# Altium project WroSat_RAD_SiPMT_detector_platform.PrjPCB (part 1 of 2)
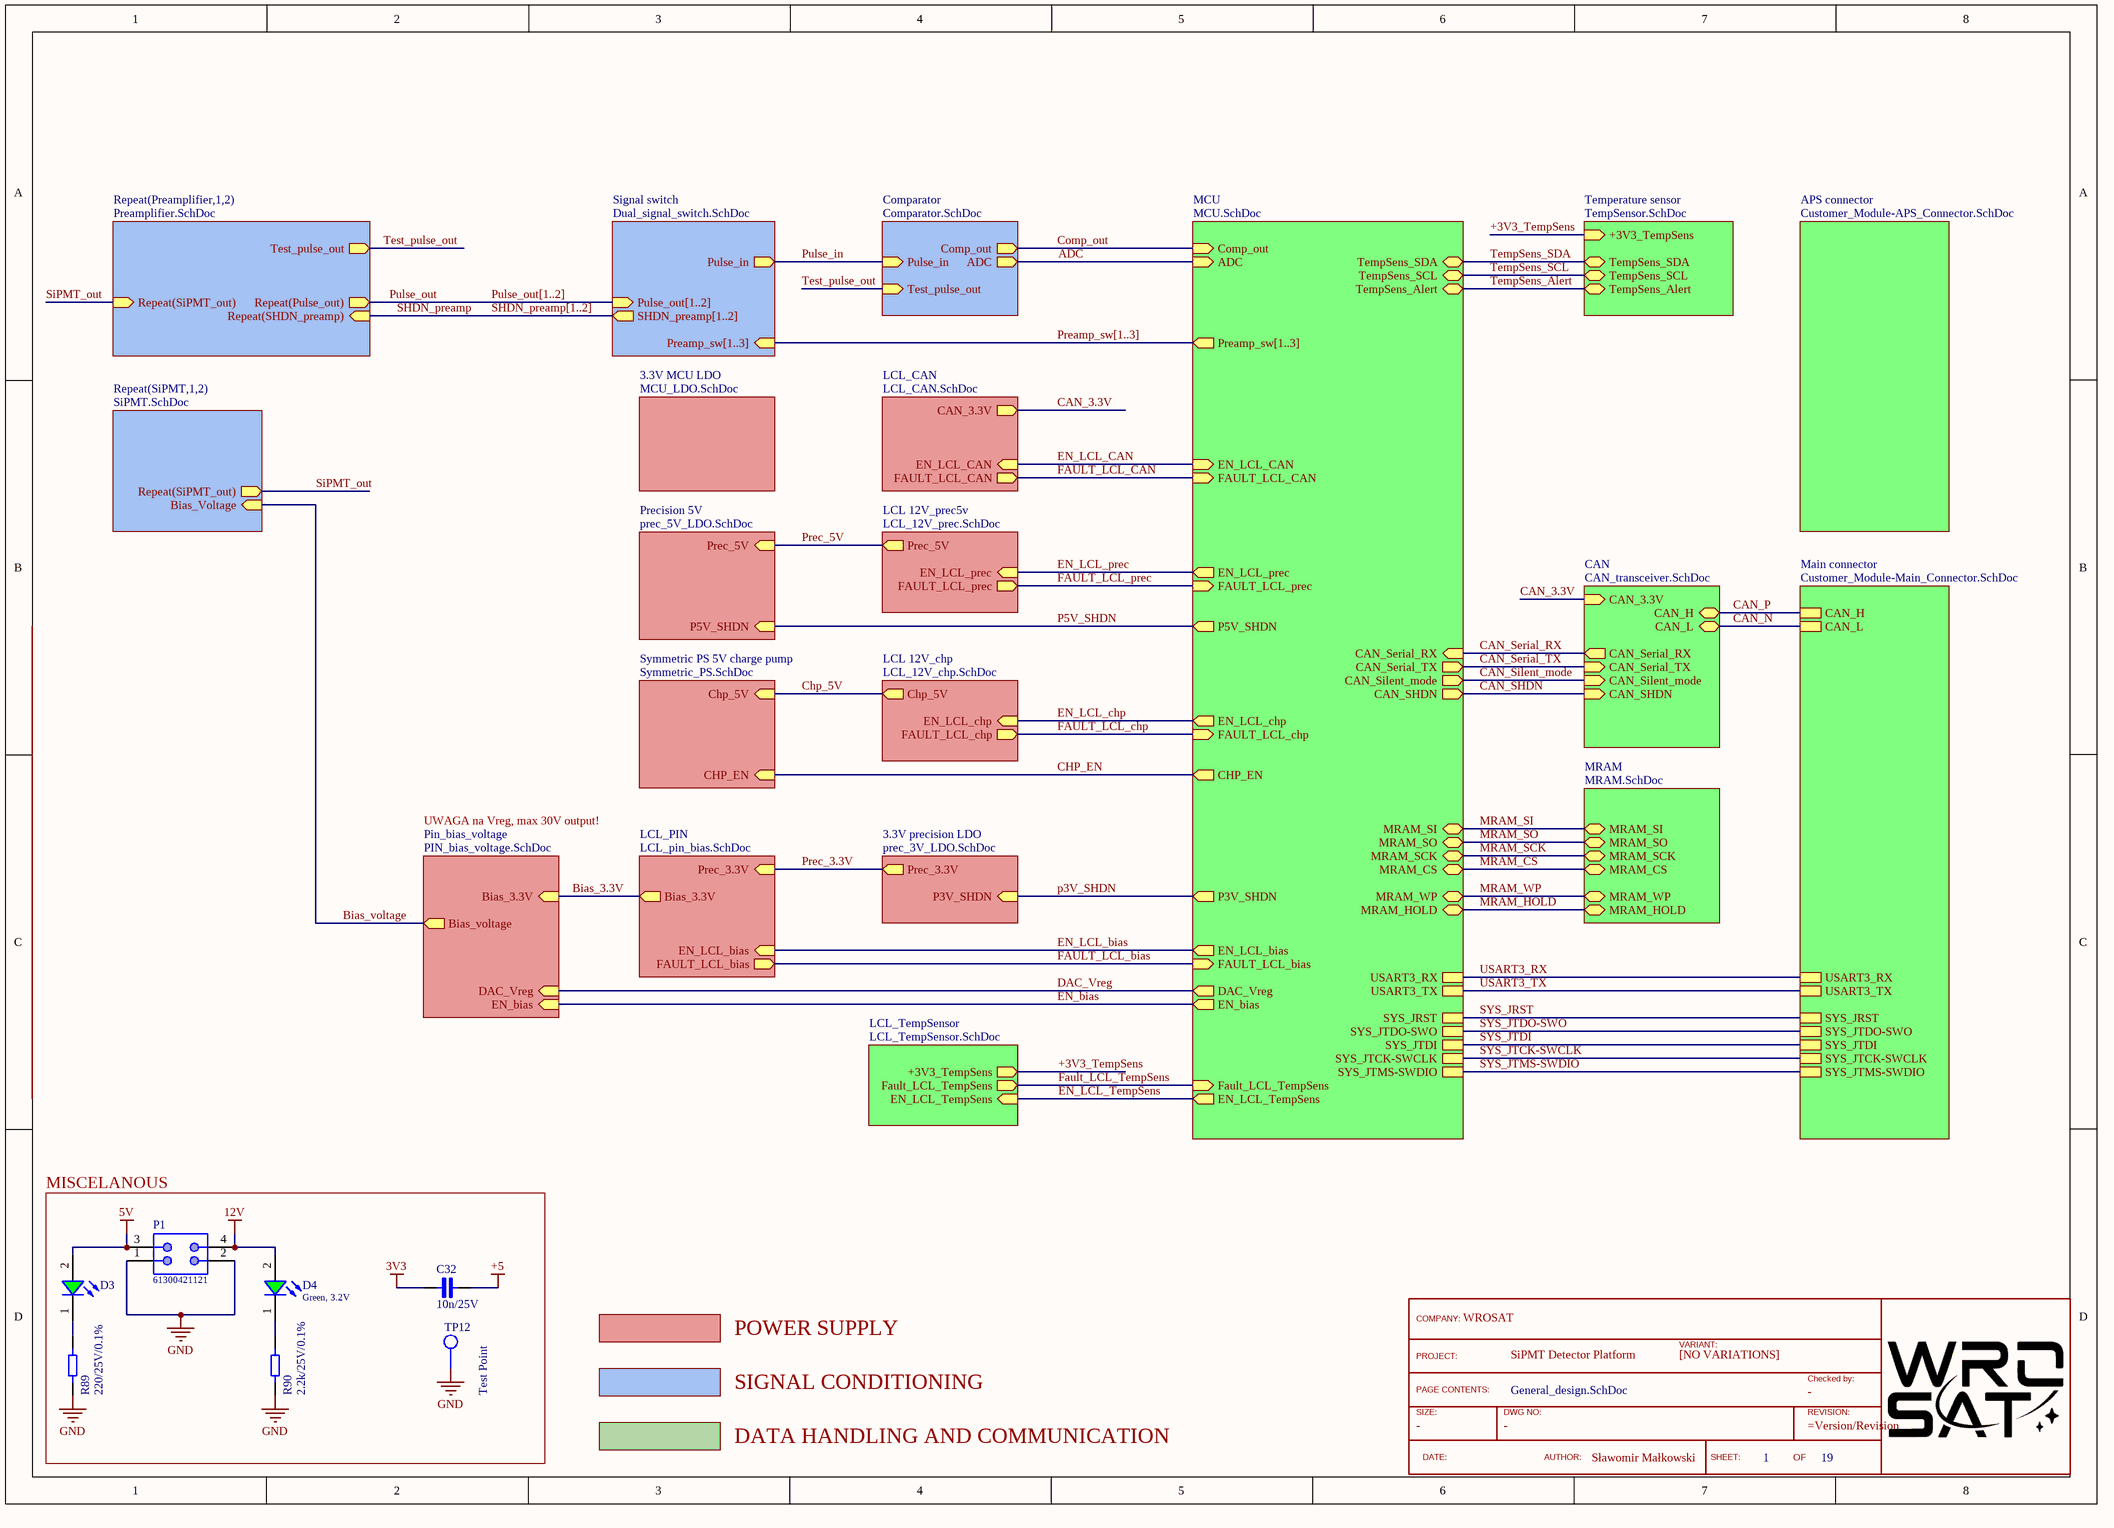
[diagram p0: General_design.SchDoc]
Company: WROSAT; Project: SiPMT Detector Platform; ProjectAuthor: Sławomir Małkowski; ProjectDate: 08.01.2020; Revision/Version: 2.0
21 sheets, 383 parts. Net scope: hierarchical (ports join the sheet entries above them; power ports are global).
Board file: WroSat_RAD_SiPMT_detector_platform.PcbDoc
Sheets:
  General_design.SchDoc
    SiPMT1 = SiPMT.SchDoc
    SiPMT2 = SiPMT.SchDoc
    Preamplifier1 = Preamplifier.SchDoc
    Preamplifier2 = Preamplifier.SchDoc
    Pin_bias_voltage = PIN_bias_voltage.SchDoc
    MCU = MCU.SchDoc
    Comparator = Comparator.SchDoc
    Symmetric PS 5V charge pump = Symmetric_PS.SchDoc
    3.3V precision LDO = prec_3V_LDO.SchDoc
    CAN = CAN_transceiver.SchDoc
    MRAM = MRAM.SchDoc
    LCL_PIN = LCL_pin_bias.SchDoc
    Precision 5V = prec_5V_LDO.SchDoc
    LCL 12V_prec5v = LCL_12V_prec.SchDoc
    LCL 12V_chp = LCL_12V_chp.SchDoc
    Signal switch = Dual_signal_switch.SchDoc
    3.3V MCU LDO = MCU_LDO.SchDoc
    LCL_CAN = LCL_CAN.SchDoc
    APS connector = Customer_Module-APS_Connector.SchDoc
    Main connector = Customer_Module-Main_Connector.SchDoc
    Temperature sensor = TempSensor.SchDoc
    LCL_TempSensor = LCL_TempSensor.SchDoc

## Sheet General_design.SchDoc
size A3; Author: Sławomir Małkowski; Organization: Altium Limited; Address1: L3, 12a Rodborough Rd; Address2: Frenchs Forest; Address3: NSW; Address4: Australia 2086; DocumentNumber: 1; SheetNumber: 1; SheetTotal: 19

### Parts
(Parts that share a designator on the sheet are numbered #1, #2 ... from top to bottom, then left to right.)
?#1  TitleBlock  (value not drawn)  (graphical)
C32  10n/25V  [Cap_0402]
D3  Green, 3.2V  [WL-SMCW_0603_H=0.7mm]  (value not drawn)
D4  Green, 3.2V  [WL-SMCW_0603_H=0.7mm]
P1  61300421121  [61300421121]
R89  220/25V/0.1%  [RES_0402]
R90  2.2k/25V/0.1%  [RES_0402]
TP12  Test Point  [Test Point SMT]

### Blocks framed on the sheet
MISCELANOUS: C32 D3 D4 P1 R89 R90 TP12

### Sub-sheets
3.3V MCU LDO = MCU_LDO.SchDoc: no entries
3.3V precision LDO = prec_3V_LDO.SchDoc: Prec_3.3V (out), P3V_SHDN (in)
APS connector = Customer_Module-APS_Connector.SchDoc: no entries
CAN = CAN_transceiver.SchDoc: CAN_3.3V (in), CAN_Serial_RX (out), CAN_Serial_TX (in), CAN_H (bidir), CAN_L (bidir), CAN_Silent_mode (in), CAN_SHDN (in)
Comparator = Comparator.SchDoc: Pulse_in (in), Comp_out (out), Test_pulse_out (in), ADC (out)
LCL 12V_chp = LCL_12V_chp.SchDoc: Chp_5V (out), EN_LCL_chp (in), FAULT_LCL_chp (out)
LCL 12V_prec5v = LCL_12V_prec.SchDoc: Prec_5V (out), EN_LCL_prec (in), FAULT_LCL_prec (out)
LCL_CAN = LCL_CAN.SchDoc: EN_LCL_CAN (in), FAULT_LCL_CAN (out), CAN_3.3V (out)
LCL_PIN = LCL_pin_bias.SchDoc: EN_LCL_bias (in), FAULT_LCL_bias (out), Prec_3.3V (in), Bias_3.3V (out)
LCL_TempSensor = LCL_TempSensor.SchDoc: +3V3_TempSens (out), Fault_LCL_TempSens (out), EN_LCL_TempSens (in)
Main connector = Customer_Module-Main_Connector.SchDoc: SYS_JTCK-SWCLK, SYS_JTMS-SWDIO, CAN_H, USART3_RX, CAN_L, SYS_JRST, USART3_TX, SYS_JTDO-SWO, SYS_JTDI
MCU = MCU.SchDoc: Preamp_sw[1..3] (out), Comp_out (in), P3V_SHDN (out), P5V_SHDN (out), CHP_EN (out), EN_LCL_bias (out), FAULT_LCL_bias (in), EN_LCL_prec (out), FAULT_LCL_prec (in), EN_LCL_chp (out), FAULT_LCL_chp (in), EN_bias (out), CAN_Serial_RX (in), CAN_Serial_TX (out), CAN_Silent_mode (out), MRAM_SO (bidir), MRAM_SCK (bidir), MRAM_WP (bidir), MRAM_HOLD (bidir), MRAM_CS (bidir), MRAM_SI (bidir), DAC_Vreg (out), CAN_SHDN (out), SYS_JRST, SYS_JTDO-SWO, SYS_JTDI, SYS_JTCK-SWCLK, SYS_JTMS-SWDIO, USART3_RX, USART3_TX, EN_LCL_CAN (in), FAULT_LCL_CAN (in), TempSens_SDA (bidir), TempSens_SCL (bidir), TempSens_Alert (bidir), Fault_LCL_TempSens (in), EN_LCL_TempSens (out), ADC (in)
MRAM = MRAM.SchDoc: MRAM_SO (bidir), MRAM_SCK (bidir), MRAM_WP (bidir), MRAM_HOLD (bidir), MRAM_CS (bidir), MRAM_SI (bidir)
Pin_bias_voltage = PIN_bias_voltage.SchDoc: Bias_voltage (out), Bias_3.3V (in), EN_bias (in), DAC_Vreg (in)
Precision 5V = prec_5V_LDO.SchDoc: Prec_5V (in), P5V_SHDN (in)
Repeat(Preamplifier,1,2) = Preamplifier.SchDoc: Repeat(SiPMT_out) (in), Repeat(Pulse_out) (out), Repeat(SHDN_preamp) (in), Test_pulse_out (out)
Repeat(SiPMT,1,2) = SiPMT.SchDoc: Bias_Voltage (in), Repeat(SiPMT_out) (out)
Signal switch = Dual_signal_switch.SchDoc: Pulse_out[1..2] (in), Pulse_in (out), Preamp_sw[1..3] (in), SHDN_preamp[1..2] (out)
Symmetric PS 5V charge pump = Symmetric_PS.SchDoc: Chp_5V (in), CHP_EN (in)
Temperature sensor = TempSensor.SchDoc: TempSens_SDA (bidir), TempSens_SCL (bidir), TempSens_Alert (bidir), +3V3_TempSens (in)

### Nets
3V3: C32.1
5V: D3.2(A) P1.3
12V: D4.2(A) P1.4
+5: C32.2
GND: P1.1 P1.2 R89.1 R90.1 TP12.1
+3V3_TempSens: sheet Temperature sensor/+3V3_TempSens, sheet LCL_TempSensor/+3V3_TempSens
ADC: sheet MCU/ADC, sheet Comparator/ADC
Bias_3.3V: sheet Pin_bias_voltage/Bias_3.3V, sheet LCL_PIN/Bias_3.3V
Bias_voltage: sheet Repeat(SiPMT,1,2)/Bias_Voltage, sheet Pin_bias_voltage/Bias_voltage
CAN_3.3V: sheet CAN/CAN_3.3V, sheet LCL_CAN/CAN_3.3V
CAN_N: sheet CAN/CAN_L, sheet Main connector/CAN_L
CAN_P: sheet CAN/CAN_H, sheet Main connector/CAN_H
CAN_Serial_RX: sheet MCU/CAN_Serial_RX, sheet CAN/CAN_Serial_RX
CAN_Serial_TX: sheet MCU/CAN_Serial_TX, sheet CAN/CAN_Serial_TX
CAN_SHDN: sheet MCU/CAN_SHDN, sheet CAN/CAN_SHDN
CAN_Silent_mode: sheet MCU/CAN_Silent_mode, sheet CAN/CAN_Silent_mode
Chp_5V: sheet Symmetric PS 5V charge pump/Chp_5V, sheet LCL 12V_chp/Chp_5V
CHP_EN: sheet MCU/CHP_EN, sheet Symmetric PS 5V charge pump/CHP_EN
Comp_out: sheet MCU/Comp_out, sheet Comparator/Comp_out
DAC_Vreg: sheet Pin_bias_voltage/DAC_Vreg, sheet MCU/DAC_Vreg
EN_bias: sheet Pin_bias_voltage/EN_bias, sheet MCU/EN_bias
EN_LCL_bias: sheet MCU/EN_LCL_bias, sheet LCL_PIN/EN_LCL_bias
EN_LCL_CAN: sheet MCU/EN_LCL_CAN, sheet LCL_CAN/EN_LCL_CAN
EN_LCL_chp: sheet MCU/EN_LCL_chp, sheet LCL 12V_chp/EN_LCL_chp
EN_LCL_prec: sheet MCU/EN_LCL_prec, sheet LCL 12V_prec5v/EN_LCL_prec
EN_LCL_TempSens: sheet MCU/EN_LCL_TempSens, sheet LCL_TempSensor/EN_LCL_TempSens
FAULT_LCL_bias: sheet MCU/FAULT_LCL_bias, sheet LCL_PIN/FAULT_LCL_bias
FAULT_LCL_CAN: sheet MCU/FAULT_LCL_CAN, sheet LCL_CAN/FAULT_LCL_CAN
FAULT_LCL_chp: sheet MCU/FAULT_LCL_chp, sheet LCL 12V_chp/FAULT_LCL_chp
FAULT_LCL_prec: sheet MCU/FAULT_LCL_prec, sheet LCL 12V_prec5v/FAULT_LCL_prec
Fault_LCL_TempSens: sheet MCU/Fault_LCL_TempSens, sheet LCL_TempSensor/Fault_LCL_TempSens
MRAM_CS: sheet MCU/MRAM_CS, sheet MRAM/MRAM_CS
MRAM_HOLD: sheet MCU/MRAM_HOLD, sheet MRAM/MRAM_HOLD
MRAM_SCK: sheet MCU/MRAM_SCK, sheet MRAM/MRAM_SCK
MRAM_SI: sheet MCU/MRAM_SI, sheet MRAM/MRAM_SI
MRAM_SO: sheet MCU/MRAM_SO, sheet MRAM/MRAM_SO
MRAM_WP: sheet MCU/MRAM_WP, sheet MRAM/MRAM_WP
p3V_SHDN: sheet MCU/P3V_SHDN, sheet 3.3V precision LDO/P3V_SHDN
P5V_SHDN: sheet MCU/P5V_SHDN, sheet Precision 5V/P5V_SHDN
Prec_3.3V: sheet 3.3V precision LDO/Prec_3.3V, sheet LCL_PIN/Prec_3.3V
Prec_5V: sheet Precision 5V/Prec_5V, sheet LCL 12V_prec5v/Prec_5V
Pulse_in: sheet Comparator/Pulse_in, sheet Signal switch/Pulse_in
Pulse_out: sheet Repeat(Preamplifier,1,2)/Repeat(Pulse_out)  [also labelled Pulse_out[1..2]]
SHDN_preamp: sheet Repeat(Preamplifier,1,2)/Repeat(SHDN_preamp)  [also labelled SHDN_preamp[1..2]]
SiPMT_out: sheet Repeat(SiPMT,1,2)/Repeat(SiPMT_out), sheet Repeat(Preamplifier,1,2)/Repeat(SiPMT_out)
SYS_JRST: sheet MCU/SYS_JRST, sheet Main connector/SYS_JRST
SYS_JTCK-SWCLK: sheet MCU/SYS_JTCK-SWCLK, sheet Main connector/SYS_JTCK-SWCLK
SYS_JTDI: sheet MCU/SYS_JTDI, sheet Main connector/SYS_JTDI
SYS_JTDO-SWO: sheet MCU/SYS_JTDO-SWO, sheet Main connector/SYS_JTDO-SWO
SYS_JTMS-SWDIO: sheet MCU/SYS_JTMS-SWDIO, sheet Main connector/SYS_JTMS-SWDIO
TempSens_Alert: sheet MCU/TempSens_Alert, sheet Temperature sensor/TempSens_Alert
TempSens_SCL: sheet MCU/TempSens_SCL, sheet Temperature sensor/TempSens_SCL
TempSens_SDA: sheet MCU/TempSens_SDA, sheet Temperature sensor/TempSens_SDA
Test_pulse_out: sheet Repeat(Preamplifier,1,2)/Test_pulse_out, sheet Comparator/Test_pulse_out
USART3_RX: sheet MCU/USART3_RX, sheet Main connector/USART3_RX
USART3_TX: sheet MCU/USART3_TX, sheet Main connector/USART3_TX
NetD3_1: D3.1(K) R89.2
NetD4_1: D4.1(K) R90.2

### Buses and harness runs
bus Preamp_sw[1..3] = sheet MCU/Preamp_sw[1..3] = sheet Signal switch/Preamp_sw[1..3]

### Notes on the sheet
- UWAGA na Vreg, max 30V output!
- POWER SUPPLY
- SIGNAL CONDITIONING
- DATA HANDLING AND COMMUNICATION
- Title
- Size:
- Date:
- A3
- Number:
- Time:
- Revision:
- Sheet
- of
- File:
- (in symbol TitleBlock) COMPANY:; VARIANT:; PROJECT:; [NO VARIATIONS]; Checked by:; PAGE CONTENTS:; SIZE:; DWG NO:; REVISION:; DATE:; AUTHOR:; SHEET:; OF

### Library data of the parts
?#1 = TitleBlock: Standard TitleBlock; DrawingNo: -; Size: -; Checked: -
C32 = Cap_0402_10n: Ceramic Capacitor 10n / 0402 / 25V / ±5%, Wurth Elektronik MLCC; ComponentLink1Description: New link; ComponentLink1URL: https://www.we-online.com/catalog/en/WCAP-CSGP-25VDC
D3 D4 = 150060GS75000: WL-SMCW SMT Mono-color Chip LED Waterclear, size 0603, Green, 3.2V, 140deg; Chip Technology: InGaN; Dominant Wavelength typ.: 525nm; Luminous Intensity typ.: 430mcd; Peak Wavelength typ.: 515nm; Viewing Angle: 140deg; ComponentLink1Description: Manufacturer; ComponentLink1URL: http://www.we-online.de; ComponentLink2URL: https://www.we-online.com/catalog/datasheet/150060GS75000.pdf; ComponentLink2Description: Datasheet; Forward Voltage typ.: 3.2V; Emitting Color: Green; Mounting Technology: SMT; Operating Temperature: -40 to +85degC; Published Date: December 2019; Part Number: 150060GS75000; Packaging: Tape and Reel; Size: 0603; Publisher: Wurth Elektronik
P1 = 61300421121: WR-PHD Pin Header, THT, pitch 2.54mm, Dual Row, Vertical, 4p; Manufacturer: Wurth Elektronik; Pin Number: 4; Rated Current: 3A; Working Voltage: 250VAC; Withstanding Voltage: 500VAC; Contact Resistance: 20mOhm; ComponentLink1Description: Manufacturer; ComponentLink1URL: http://www.we-online.de; ComponentLink2Description: Datasheet; ComponentLink2URL: https://www.we-online.com/catalog/datasheet/61300421121.pdf; Manufacturer Part Number: 61300421121; Published Date: May 2020; Pitch: 2.54mm; Operating Temperature: -40 to +105degC; Mounting Technology: THT; Packaging: Bag; Gender: Pin Header; Row Number: Dual; Orientation: Vertical
R89 = Res_0402_1: Vishay, thin film resistor 1/25V/0.1%
R90 = Res_0402_1: Vishay, thin film resistor 2.2k/25V/0.1%

## Sheet SiPMT.SchDoc
size A4; Organization: Altium Limited; Address1: L3, 12a Rodborough Rd; Address2: Frenchs Forest; Address3: NSW; Address4: Australia 2086; DocumentNumber: 19; SheetNumber: 19; SheetTotal: 19
Used 2 times, as channels SiPMT1, SiPMT2. Parts and nets are listed once, with the designators drawn on the sheet.
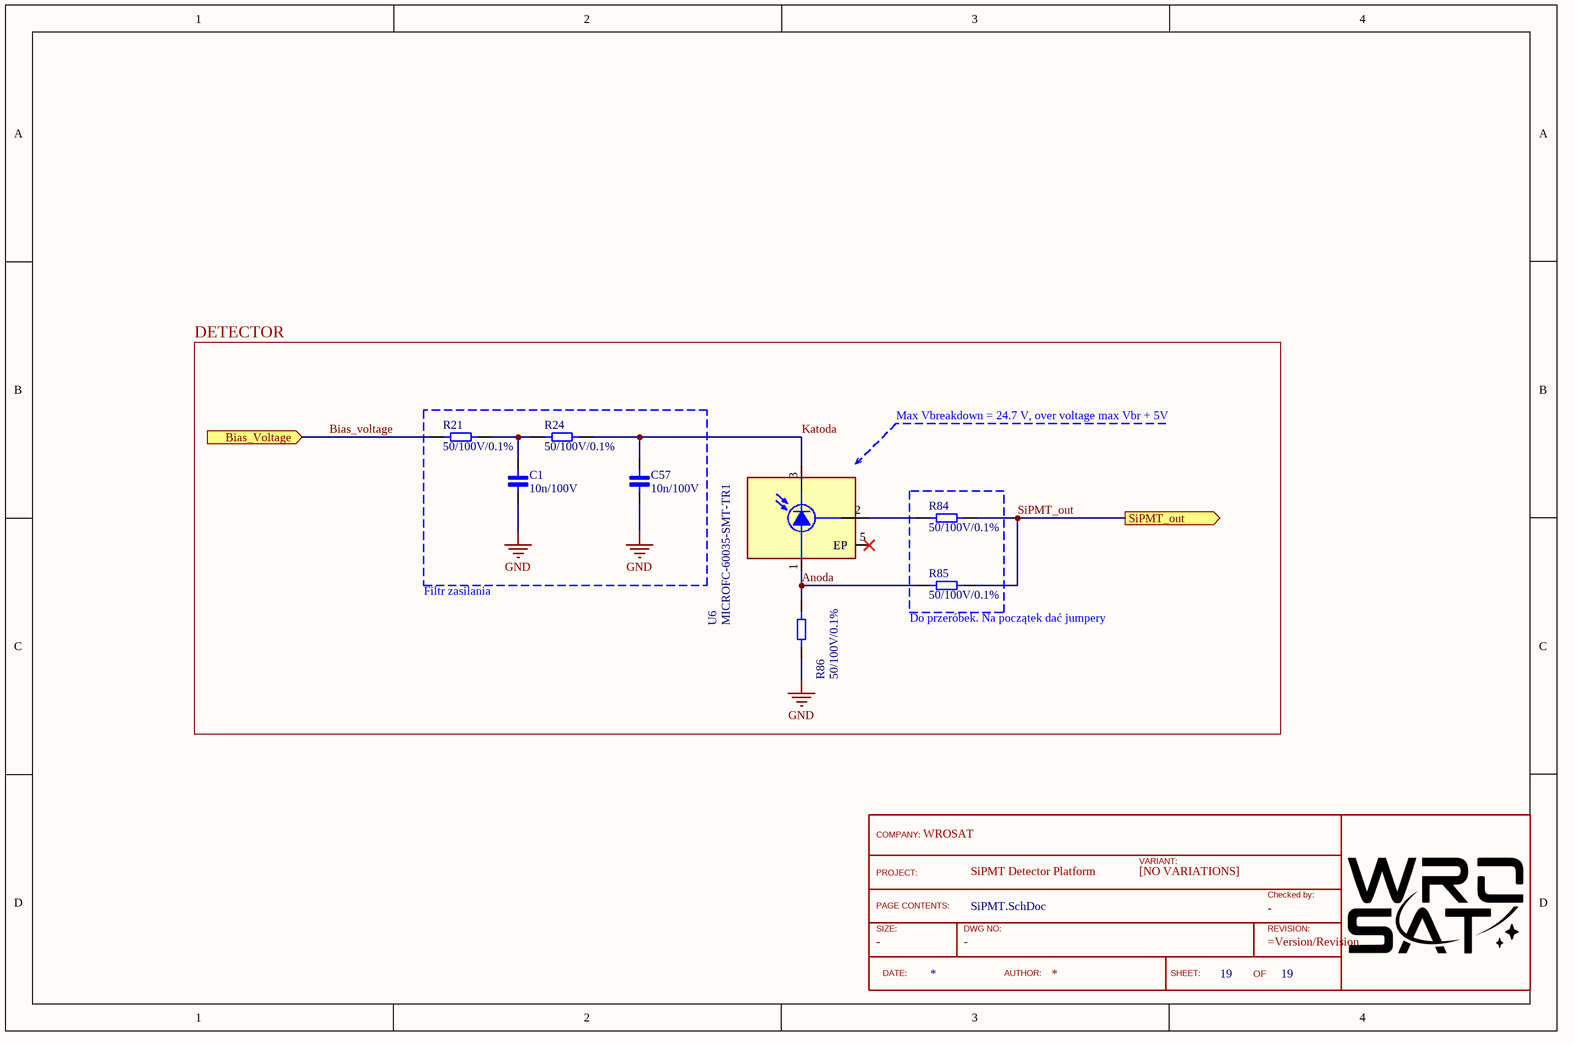
[diagram p1: SiPMT.SchDoc]

### Parts
?  TitleBlock  (value not drawn)  (graphical)
C1  10n/100V  [CAP_0603]
C57  10n/100V  [CAP_0603]
R21  50/100V/0.1%  [RES_0603]
R24  50/100V/0.1%  [RES_0603]
R84  50/100V/0.1%  [RES_0603]
R85  50/100V/0.1%  [RES_0603]
R86  50/100V/0.1%  [RES_0603]
U6  MICROFC-60035-SMT-TR1  [XDCR_MICROFC-60035-SMT-TR1]

### Blocks framed on the sheet
DETECTOR: C1 C57 R21 R24 R84-R86 U6

### Ports
Bias_Voltage (in), SiPMT_out (out)

### Nets
GND: C1.1 C57.1 R86.1
Anoda: R85.2 R86.2 U6.1(P-ANODE)
Bias_voltage: R21.1 ; port Bias_Voltage
Katoda: C57.2 R24.2 U6.3(N-CATHODE)
SiPMT_out: R84.1 R85.1 ; port SiPMT_out
NetC1_2: C1.2 R21.2 R24.1
NetR84_2: R84.2 U6.2(F-FAST_OUTPUT)

Not connected (* = marked no-connect by the designer): U6 5(EP)*

### Channels
SiPMT1: designators end in _SiPMT1; ports Bias_Voltage=Bias_voltage SiPMT_out=SiPMT_out
SiPMT2: designators end in _SiPMT2; ports Bias_Voltage=Bias_voltage SiPMT_out=SiPMT_out

### Notes on the sheet
- Max Vbreakdown = 24.7 V, over voltage max Vbr + 5V
- Filtr zasilania
- (near R85) Do przeróbek. Na początek dać jumpery
- Title
- Size:
- Date:
- A3
- Number:
- Time:
- Revision:
- Sheet
- of
- File:
- (in symbol TitleBlock) COMPANY:; VARIANT:; PROJECT:; [NO VARIATIONS]; Checked by:; PAGE CONTENTS:; SIZE:; DWG NO:; REVISION:; DATE:; AUTHOR:; SHEET:; OF

### Library data of the parts
? = TitleBlock: Standard TitleBlock; DrawingNo: -; Size: -; Checked: -
C1 C57 = Cap_0603_10n_100V: Ceramic Capacitor 10n / 0603 / 100V / ±5%, Wurth Elektronik MLCC; ComponentLink1Description: New link; ComponentLink1URL: https://www.we-online.com/catalog/en/WCAP-CSGP-25VDC
R21 R24 R84-R86 = Res_0603_50: Vishay, thin film resistor 50/100V/0.1%
U6 = MICROFC-60035-SMT-TR1: Photodiode 420nm 1ns 4-SMD, No Lead; MF: ON Semiconductor; Price: None; SnapEDA_Link: https://www.snapeda.com/parts/MICROFC-60035-SMT-TR1/ON%20Semiconductor/view-part/3228590/?ref=snap; Availability: Unavailable; Value: *; MP: MICROFC-60035-SMT-TR1; Package: SMD-4 ON Semiconductor

## Sheet Preamplifier.SchDoc
size A3; Organization: Altium Limited; Address1: L3, 12a Rodborough Rd; Address2: Frenchs Forest; Address3: NSW; Address4: Australia 2086; DocumentNumber: 2; SheetNumber: 2; SheetTotal: 19
Used 2 times, as channels Preamplifier1, Preamplifier2. Parts and nets are listed once, with the designators drawn on the sheet.
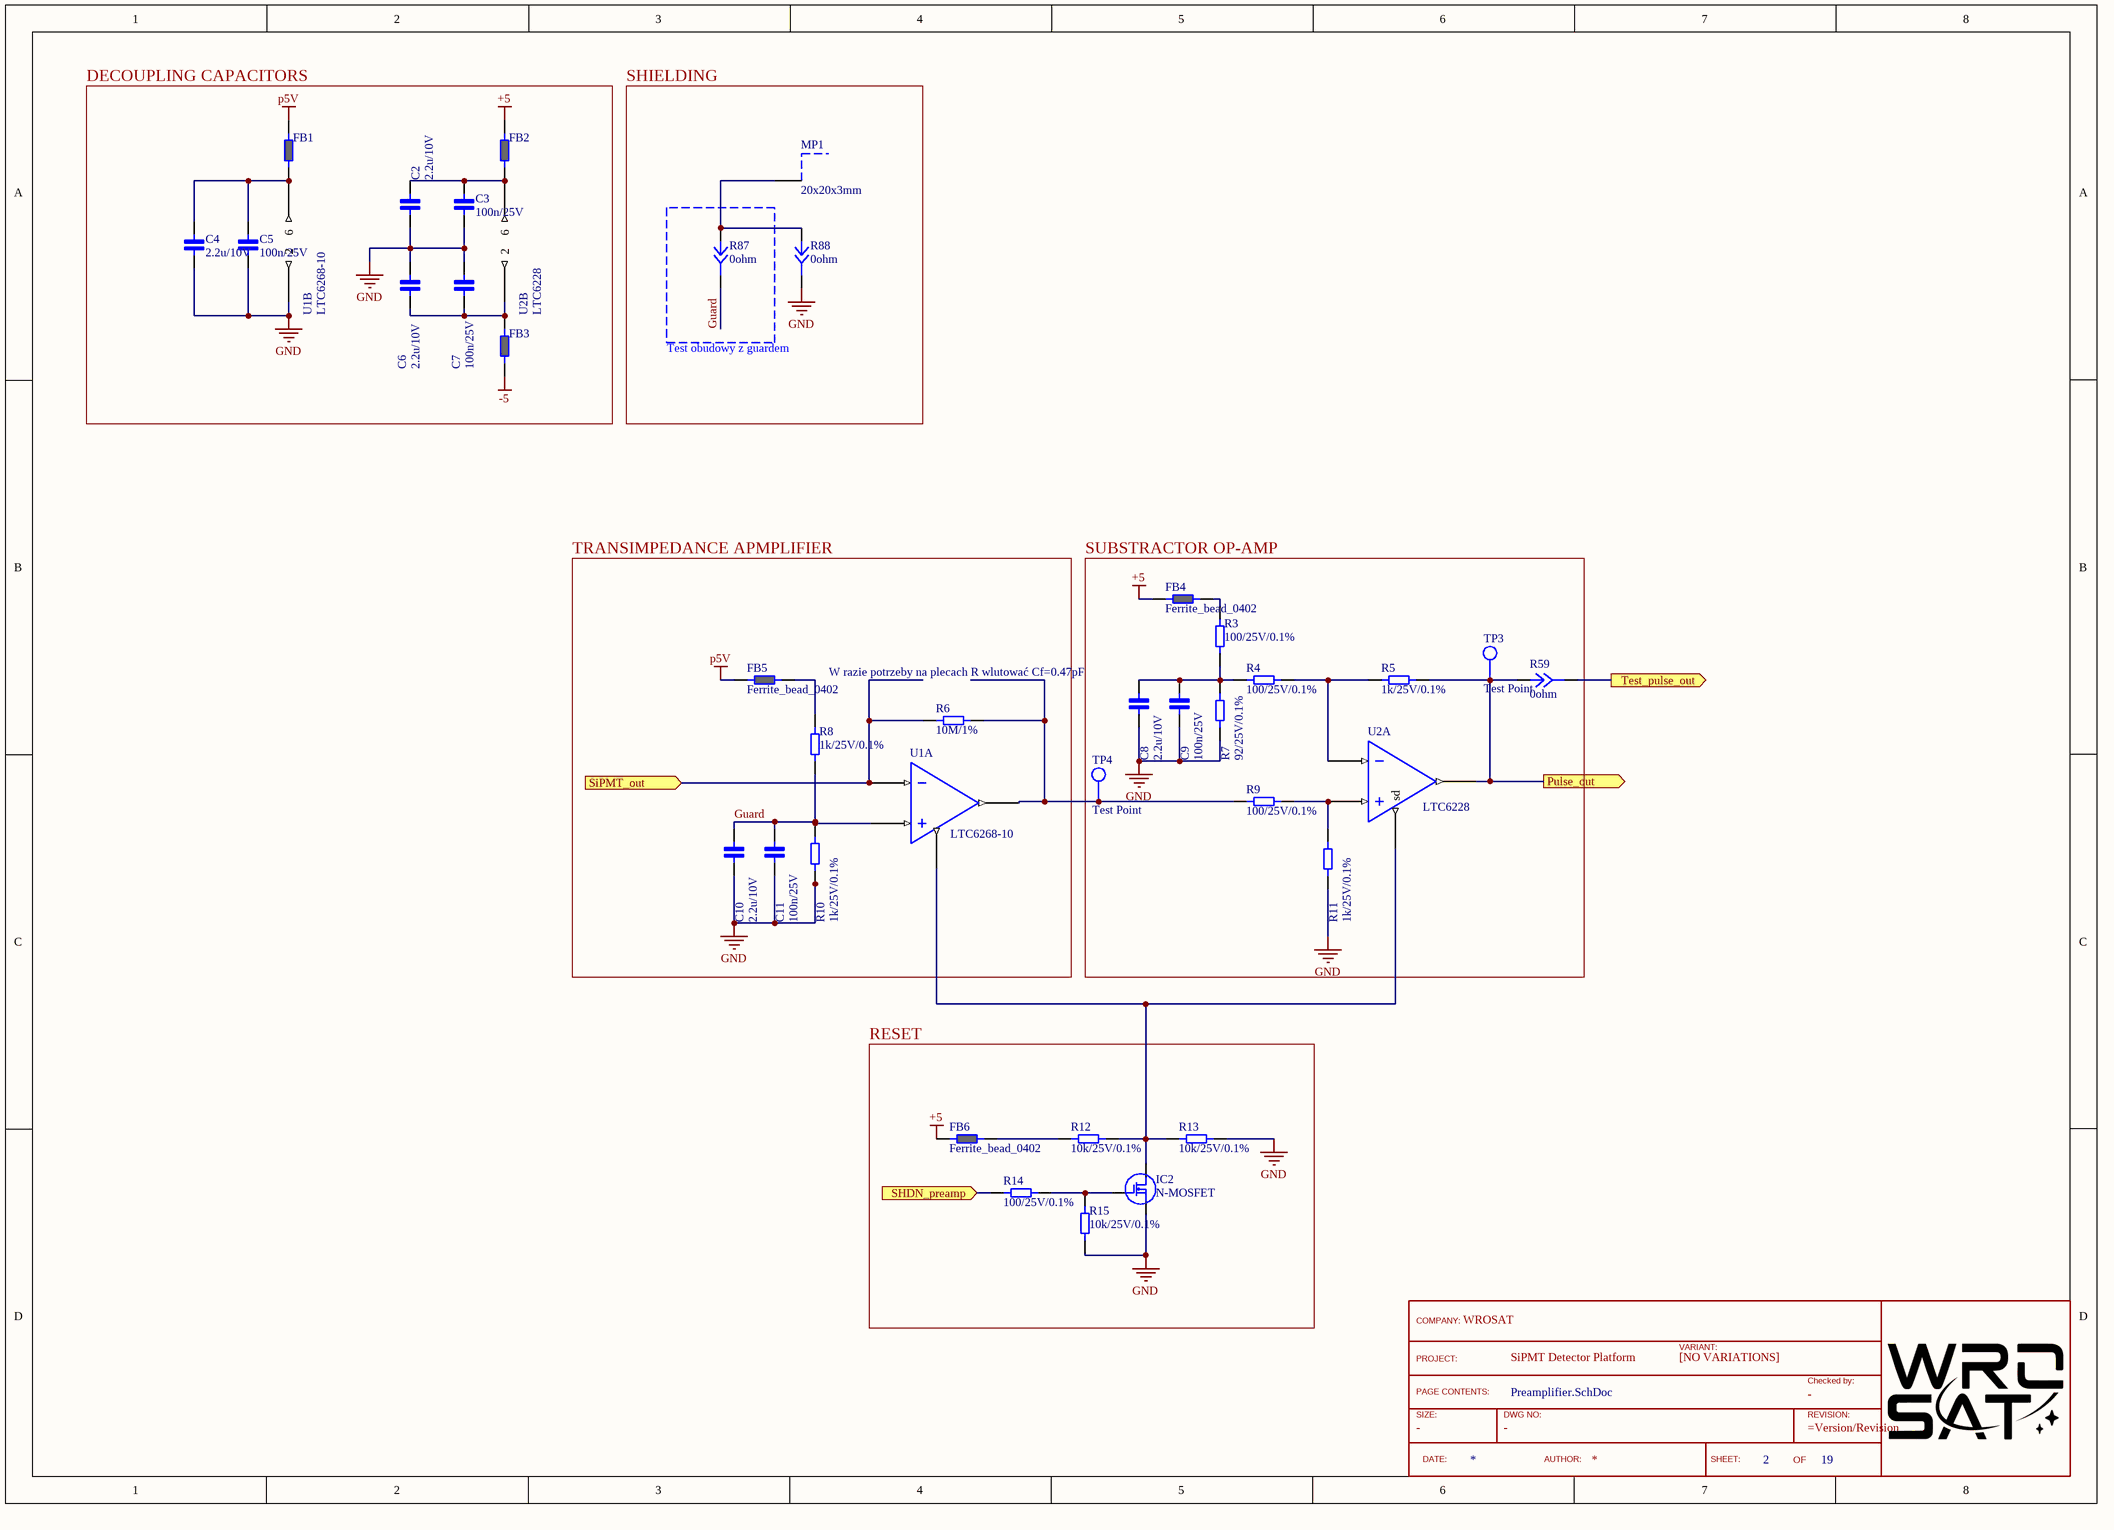
[diagram p2: Preamplifier.SchDoc]

### Parts
?  TitleBlock  (value not drawn)  (graphical)
C2  2.2u/10V  [Cap_0402]
C3  100n/25V  [Cap_0402]
C4  2.2u/10V  [Cap_0402]
C5  100n/25V  [Cap_0402]
C6  2.2u/10V  [Cap_0402]
C7  100n/25V  [Cap_0402]
C8  2.2u/10V  [Cap_0402]
C9  100n/25V  [Cap_0402]
C10  2.2u/10V  [Cap_0402]
C11  100n/25V  [Cap_0402]
FB1  Ferrite_bead_0402  [FERRITE_0402]  (value not drawn)
FB2  Ferrite_bead_0402  [FERRITE_0402]  (value not drawn)
FB3  Ferrite_bead_0402  [FERRITE_0402]  (value not drawn)
FB4  Ferrite_bead_0402  [FERRITE_0402]
FB5  Ferrite_bead_0402  [FERRITE_0402]
FB6  Ferrite_bead_0402  [FERRITE_0402]
IC2  N-MOSFET  [SOT23-3]
MP1  20x20x3mm  [36103205S]
R3  100/25V/0.1%  [RES_0402]
R4  100/25V/0.1%  [RES_0402]
R5  1k/25V/0.1%  [RES_0402]
R6  10M/1%  [RES_1206_prec]
R7  92/25V/0.1%  [RES_0402]
R8  1k/25V/0.1%  [RES_0402]
R9  100/25V/0.1%  [RES_0402]
R10  1k/25V/0.1%  [RES_0402]
R11  1k/25V/0.1%  [RES_0402]
R12  10k/25V/0.1%  [RES_0402]
R13  10k/25V/0.1%  [RES_0402]
R14  100/25V/0.1%  [RES_0402]
R15  10k/25V/0.1%  [RES_0402]
R59  0ohm  [Jumper 2]
R87  0ohm  [Jumper 2]
R88  0ohm  [Jumper 2]
TP3  Test Point  [Test Point SMT]
TP4  Test Point  [Test Point SMT]
U1  LTC6268-10  [SOT-23-6]  (parts A,B of 2)
U2  LTC6228  [SOT-23-6]  (parts A,B of 2)

### Blocks framed on the sheet
DECOUPLING CAPACITORS: C2-C7 FB1-FB3 U1 U2
SHIELDING: MP1 R87 R88
TRANSIMPEDANCE APMPLIFIER: C10 C11 FB5 R6 R8 R10 U1
SUBSTRACTOR OP-AMP: C8 C9 FB4 R3-R5 R7 R9 R11 R59 TP3 TP4 U2
RESET: FB6 IC2 R12-R15

### Ports
Pulse_out (out), SHDN_preamp (in), SiPMT_out (in), Test_pulse_out (out)

### Nets
+5: FB2.2 FB4.1 FB6.1
-5: FB3.1
GND: C2.1 C3.1 C4.1 C5.1 C6.2 C7.2 C8.1 C9.1 C10.1 C11.1 IC2.2(S) R7.1 R10.1 R11.1 R13.2 R15.1 R88.2 U1.2
p5V: FB1.2 FB5.1
Guard: C10.2 C11.2 R8.1 R10.2 R87.2 U1.3
Pulse_out: R5.2 R59.1 TP3.1 U2.1 ; port Pulse_out
SHDN_preamp: R14.1 ; port SHDN_preamp
SiPMT_out: R6.1 U1.4 ; port SiPMT_out
Test_pulse_out: R59.2 ; port Test_pulse_out
NetC2_2: C2.2 C3.2 FB2.1 U2.6
NetC4_2: C4.2 C5.2 FB1.1 U1.6
NetC6_1: C6.1 C7.1 FB3.2 U2.2
NetC8_2: C8.2 C9.2 R3.1 R4.1 R7.2
NetFB4_2: FB4.2 R3.2
NetFB5_2: FB5.2 R8.2
NetFB6_2: FB6.2 R12.1
NetIC2_1: IC2.1(G) R14.2 R15.2
NetIC2_3: IC2.3(D) R12.2 R13.1 U1.5(sd) U2.5(sd)
NetMP1_1: MP1.1 R87.1 R88.1
NetR4_2: R4.2 R5.1 U2.4
NetR6_2: R6.2 R9.1 TP4.1 U1.1
NetR9_2: R9.2 R11.2 U2.3

### Channels
Preamplifier1: designators end in _Preamplifier1; ports Pulse_out=Pulse_out1 SHDN_preamp=SHDN_preamp1 SiPMT_out=SiPMT_out Test_pulse_out=Test_pulse_out
Preamplifier2: designators end in _Preamplifier2; ports Pulse_out=Pulse_out2 SHDN_preamp=SHDN_preamp2 SiPMT_out=SiPMT_out Test_pulse_out=Test_pulse_out

### Notes on the sheet
- Test obudowy z guardem
- (near C8) W razie potrzeby na plecach R wlutować Cf=0.47pF
- Title
- Size:
- Date:
- A3
- Number:
- Time:
- Revision:
- Sheet
- of
- File:
- (in symbol TitleBlock) COMPANY:; VARIANT:; PROJECT:; [NO VARIATIONS]; Checked by:; PAGE CONTENTS:; SIZE:; DWG NO:; REVISION:; DATE:; AUTHOR:; SHEET:; OF

### Library data of the parts
? = TitleBlock: Standard TitleBlock; DrawingNo: -; Size: -; Checked: -
C2 C4 C6 C8 C10 = Cap_0402_2.2u: Ceramic Capacitor 2.2uF / 0402 / 10V / ±5%, Wurth Elektronik MLCC
C3 C5 C7 C9 C11 = Cap_0402_100n: Ceramic Capacitor 100n / 0402 / 25V / ±5%, Wurth Elektronik MLCC; ComponentLink1Description: New link; ComponentLink1URL: https://www.we-online.com/catalog/en/WCAP-CSGP-25VDC
FB1-FB6 = Ferrite_bead_0402: Ferrite bead, wurth 74269241102
IC2 = BSS138K: n-mosfet 50V, low threshold; Manufacturer: NXP Semiconductors; Manufacturer Part Number: BF861C; Supplier 1: Arrow Electronics; RoHS: Yes; Category: Uncategorized; Number of Pins: 3; ComponentLink1URL: http://docs-usa.electrocomponents.com/techlib:/itc_doclist_US.htm?stockno=6262412&src-supplier=Allied+Electronics; ComponentLink1Description: http://docs-usa.electrocomponents.com/techlib:/itc_doclist_US.htm?stockno=6262412&src-supplier=Allied+Electronics; Supplier Part Number 1: BF861C
MP1 = 36103205S: WE-SHC Shielding Cabinet, SMT Frame, Tin Plated, Tray, 20x20x3mm; Manufacturer: Wurth Elektronik; Base Material: Steel; ComponentLink1Description: Manufacturer; ComponentLink1URL: http://www.we-online.de; ComponentLink2Description: Datasheet; ComponentLink2URL: https://www.we-online.com/catalog/datasheet/36103205S.pdf; Operating Temperature: -40 to +125degC; Packaging: Tray; Plating: Tin; Length: 20mm; Type: SMD Frame; Height: 3mm; Manufacturer Part Number: 36103205S; Mounting Technology: SMT; Published Date: April 2020; Width: 20mm
R3 R4 R9 R14 = Res_0402_100: Vishay, thin film resistor 100/25V/0.1%
R5 R8 R10 R11 = Res_0402_1k: Vishay, thin film resistor 1k/25V/0.1%
R6 = Prec_res_10M: Res Thin Film 1206 10M Ohm 0.1% 0.33W(1/3W) ±50ppm/C Sulfur Resistant Pad SMD T/R; Manufacturer: Vishay Dale; Manufacturer Part Number: P1206H1005BGT; Temperature Coefficient: 50ppm/°C; Resistance: 10MR; Supplier 1: Mouser; RoHS: No; Category: Chip SMD Resistors; Stock 1: 96; Pricing 1: 1=7.55000, 10=6.80000, 50=6.19000, 100=5.59000, 200=5.14000, 500=4.68000, 1000=4.08000, 2500=3.93000, 5000=3.77000 (USD); Case/Package: 1206; Contact Plating: Gold; Min Operating Temperature: -55°C; Max Operating Temperature: 155°C; Resistor Type: Thin Film; Tolerance: 0.1%; Packaging: Tape and Reel; Radiation Hardening: No; ComponentLink1URL: https://datasheet.ciiva.com/9051/p-9051054.pdf?src-supplier=Avnet; ComponentLink1Description: https://datasheet.ciiva.com/9051/p-9051054.pdf?src-supplier=Avnet
R7 = Res_0402_92: Vishay, thin film resistor 92/25V/0.1%
R12 R13 R15 = Res_0402_10k: Vishay, thin film resistor 10k/25V/0.1%
R59 R87 R88 = Jumper
U1 = LTC6268: 4 ghz, ultra-low noise opamp; ComponentLink1Description: New link; ComponentLink1URL: https://pl.mouser.com/datasheet/2/609/626810f-1279531.pdf
U2 = LTC6228: 0.88nV/√Hz 730MHz, 500V/µs, / Low Distortion Rail-to-Rail Output Op / Amps with Shutdown; ComponentLink1Description: New link; ComponentLink1URL: https://pl.mouser.com/datasheet/2/609/LTC6228_6229-1660243.pdf

## Sheet PIN_bias_voltage.SchDoc
size A3; Organization: Altium Limited; Address1: L3, 12a Rodborough Rd; Address2: Frenchs Forest; Address3: NSW; Address4: Australia 2086; DocumentNumber: 3; SheetNumber: 3; SheetTotal: 19
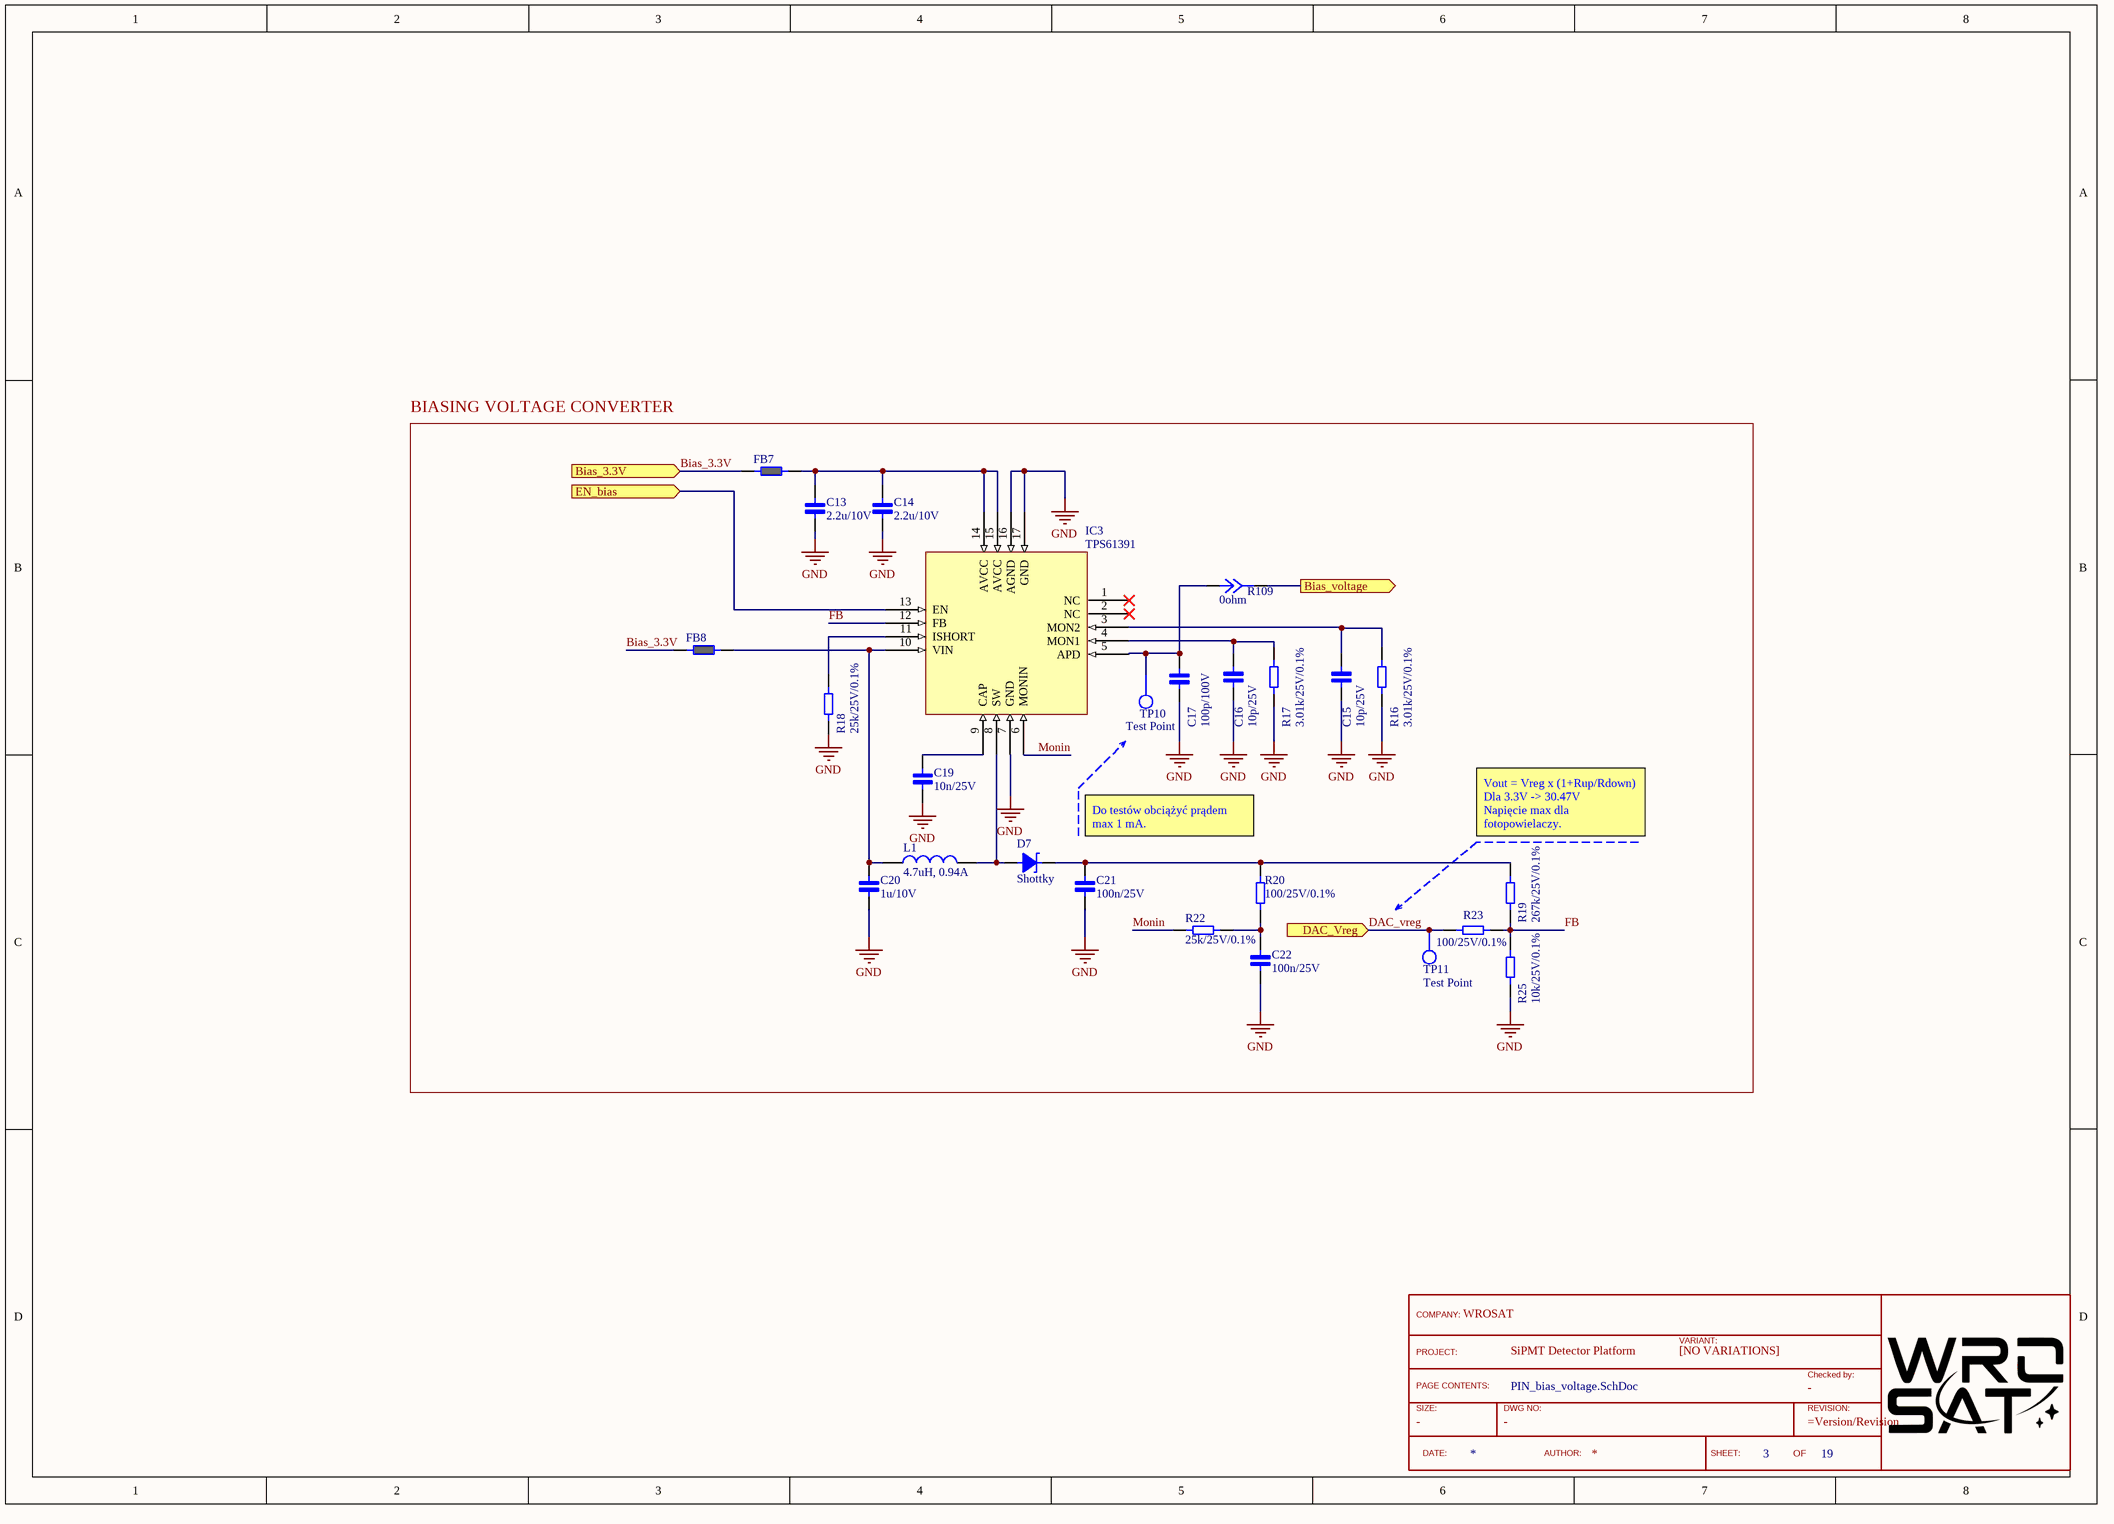
[diagram p3: PIN_bias_voltage.SchDoc]

### Parts
(Parts that share a designator on the sheet are numbered #1, #2 ... from top to bottom, then left to right.)
?#2  TitleBlock  (value not drawn)  (graphical)
C13  2.2u/10V  [Cap_0402]
C14  2.2u/10V  [Cap_0402]
C15  10p/25V  [Cap_0402]
C16  10p/25V  [Cap_0402]
C17  100p/100V  [Cap_0402]
C19  10n/25V  [Cap_0402]
C20  1u/10V  [Cap_0402]
C21  100n/25V  [Cap_0402]
C22  100n/25V  [Cap_0402]
D7  Shottky  [SOD323]
FB7  Ferrite_bead_0402  [FERRITE_0402]  (value not drawn)
FB8  Ferrite_bead_0402  [FERRITE_0402]  (value not drawn)
IC3  TPS61391  [WQFN16]
L1  4.7uH, 0.94A  [WE-MAPI_2510]
R16  3.01k/25V/0.1%  [RES_0402]
R17  3.01k/25V/0.1%  [RES_0402]
R18  25k/25V/0.1%  [RES_0402]
R19  267k/25V/0.1%  [RES_0402]
R20  100/25V/0.1%  [RES_0402]
R22  25k/25V/0.1%  [RES_0402]
R23  100/25V/0.1%  [RES_0402]
R25  10k/25V/0.1%  [RES_0402]
R109  0ohm  [Jumper 2]
TP10  Test Point  [Test Point SMT]
TP11  Test Point  [Test Point SMT]

### Blocks framed on the sheet
BIASING VOLTAGE CONVERTER: C13-C17 C19-C22 D7 FB7 FB8 IC3 L1 R16-R20 R22 R23 R25 R109 TP10 TP11

### Ports
Bias_3.3V (in), Bias_voltage (out), DAC_Vreg (in), EN_bias (in)

### Nets
GND: C13.1 C14.1 C15.1 C16.1 C17.1 C19.1 C20.1 C21.1 C22.1 IC3.7(GND) IC3.16(AGND) IC3.17(GND) R16.1 R17.1 R18.1 R25.1
Bias_3.3V: FB7.1 FB8.1 ; port Bias_3.3V
Bias_voltage: R109.2 ; port Bias_voltage
DAC_Vreg: R23.1 TP11.1 ; port DAC_Vreg
EN_bias: IC3.13(EN) ; port EN_bias
FB: IC3.12(FB) R19.1 R23.2 R25.2
Monin: IC3.6(MONIN) R22.1
NetC13_2: C13.2 C14.2 FB7.2 IC3.14(AVCC) IC3.15(AVCC)
NetC15_2: C15.2 IC3.3(MON2) R16.2
NetC16_2: C16.2 IC3.4(MON1) R17.2
NetC17_2: C17.2 IC3.5(APD) R109.1 TP10.1
NetC19_2: C19.2 IC3.9(CAP)
NetC20_2: C20.2 FB8.2 IC3.10(VIN) L1.1
NetC21_2: C21.2 D7.2 R19.2 R20.2
NetC22_2: C22.2 R20.1 R22.2
NetD7_1: D7.1 IC3.8(SW) L1.2
NetIC3_11: IC3.11(ISHORT) R18.2

Not connected (* = marked no-connect by the designer): IC3 1(NC)* 2(NC)*

### Notes on the sheet
- Do testów obciążyć prądem max 1 mA.
- (near R19) Vout = Vreg x (1+Rup/Rdown)
  Dla 3.3V -> 30.47V
  Napięcie max dla fotopowielaczy.
- Title
- Size:
- Date:
- A3
- Number:
- Time:
- Revision:
- Sheet
- of
- File:
- (in symbol TitleBlock) COMPANY:; VARIANT:; PROJECT:; [NO VARIATIONS]; PAGE CONTENTS:; Checked by:; SIZE:; DWG NO:; REVISION:; DATE:; AUTHOR:; SHEET:; OF

### Library data of the parts
?#2 = TitleBlock: Standard TitleBlock; DrawingNo: -; Size: -; Checked: -
C13 C14 = Cap_0402_2.2u: as C2 on sheet Preamplifier
C15 C16 = Cap_0402_10p: 0402 / 25V / ±5%, Wurth Elektronik MLCC; ComponentLink1Description: New link; ComponentLink1URL: https://www.we-online.com/catalog/en/WCAP-CSGP-25VDC
C17 = Cap_0402_100p_hv: 0402 / 100V / ±5%, Wurth Elektronik MLCC; ComponentLink1Description: New link; ComponentLink1URL: https://www.we-online.com/catalog/en/WCAP-CSGP-25VDC
C19 = Cap_0402_10n: as C32 on sheet General_design; ComponentLink1Description: New link; ComponentLink1URL: https://www.we-online.com/catalog/en/WCAP-CSGP-25VDC
C20 = Cap_0402_1u: Ceramic Capacitor 1uF / 0402 / 10V / ±5%, Wurth Elektronik MLCC
C21 C22 = Cap_0402_100n: as C3 on sheet Preamplifier; ComponentLink1Description: New link; ComponentLink1URL: https://www.we-online.com/catalog/en/WCAP-CSGP-25VDC
D7 = 1SS355VMFHTE-17: Schottky diode, 90V, 100mA, 1.2V, 4ns; ComponentLink1Description: New link; ComponentLink1URL: http://www.farnell.com/datasheets/2296360.pdf?_ga=2.82751826.559014072.1603739164-289843645.1554760282&_gac=1.61669086.1603127928.Cj0KCQjw8rT8BRCbARIsALWiOvSVwk9r5eslWLPnwyA40yS03dA_HOx56l5PpmQm_xU-UzALJc7kcHAaAvh7EALw_wcB
FB7 FB8 = Ferrite_bead_0402: Ferrite bead, wurth 74269241102
IC3 = TPS61391: TPS61391 85-VOUT Boost Converter with Current Mirror Integrated; ComponentLink1Description: New link; ComponentLink1URL: https://www.ti.com/lit/ds/symlink/tps61391.pdf
L1 = 74438323047: WE-MAPI SMT Power Inductor, size 2510, 4.7uH, 0.94A; Manufacturer: Wurth Elektronik; DC Resistance typ.: 338mOhm; DC Resistance max.: 388mOhm; Self Resonant Frequency: 35MHz; Saturation Current: 1.75A; ComponentLink1Description: Manufacturer; ComponentLink1URL: http://www.we-online.de; ComponentLink2Description: Datasheet; ComponentLink2URL: https://www.we-online.com/catalog/datasheet/74438323047.pdf; Mounting Technology: SMT; Operating Temperature: -40 to +125degC; Packaging: Tape and Reel; Published Date: April 2020; Size: 2510; Inductance: 4.7uH; Manufacturer Part Number: 74438323047; Rated Current: 0.94A
R16 R17 = Res_0402_3.01k: Vishay, thin film resistor 3.01k/25V/0.1%
R18 R22 = Res_0402_25k: Vishay, thin film resistor 25k/25V/0.1%
R19 = Res_0402_267k: Vishay, thin film resistor 267k/25V/0.1%
R20 R23 = Res_0402_100: Vishay, thin film resistor 100/25V/0.1%
R25 = Res_0402_10k: Vishay, thin film resistor 10k/25V/0.1%
R109 = Jumper

## Sheet MCU.SchDoc
size A3; Organization: Altium Limited; Address1: L3, 12a Rodborough Rd; Address2: Frenchs Forest; Address3: NSW; Address4: Australia 2086; DocumentNumber: 4; SheetNumber: 4; SheetTotal: 19
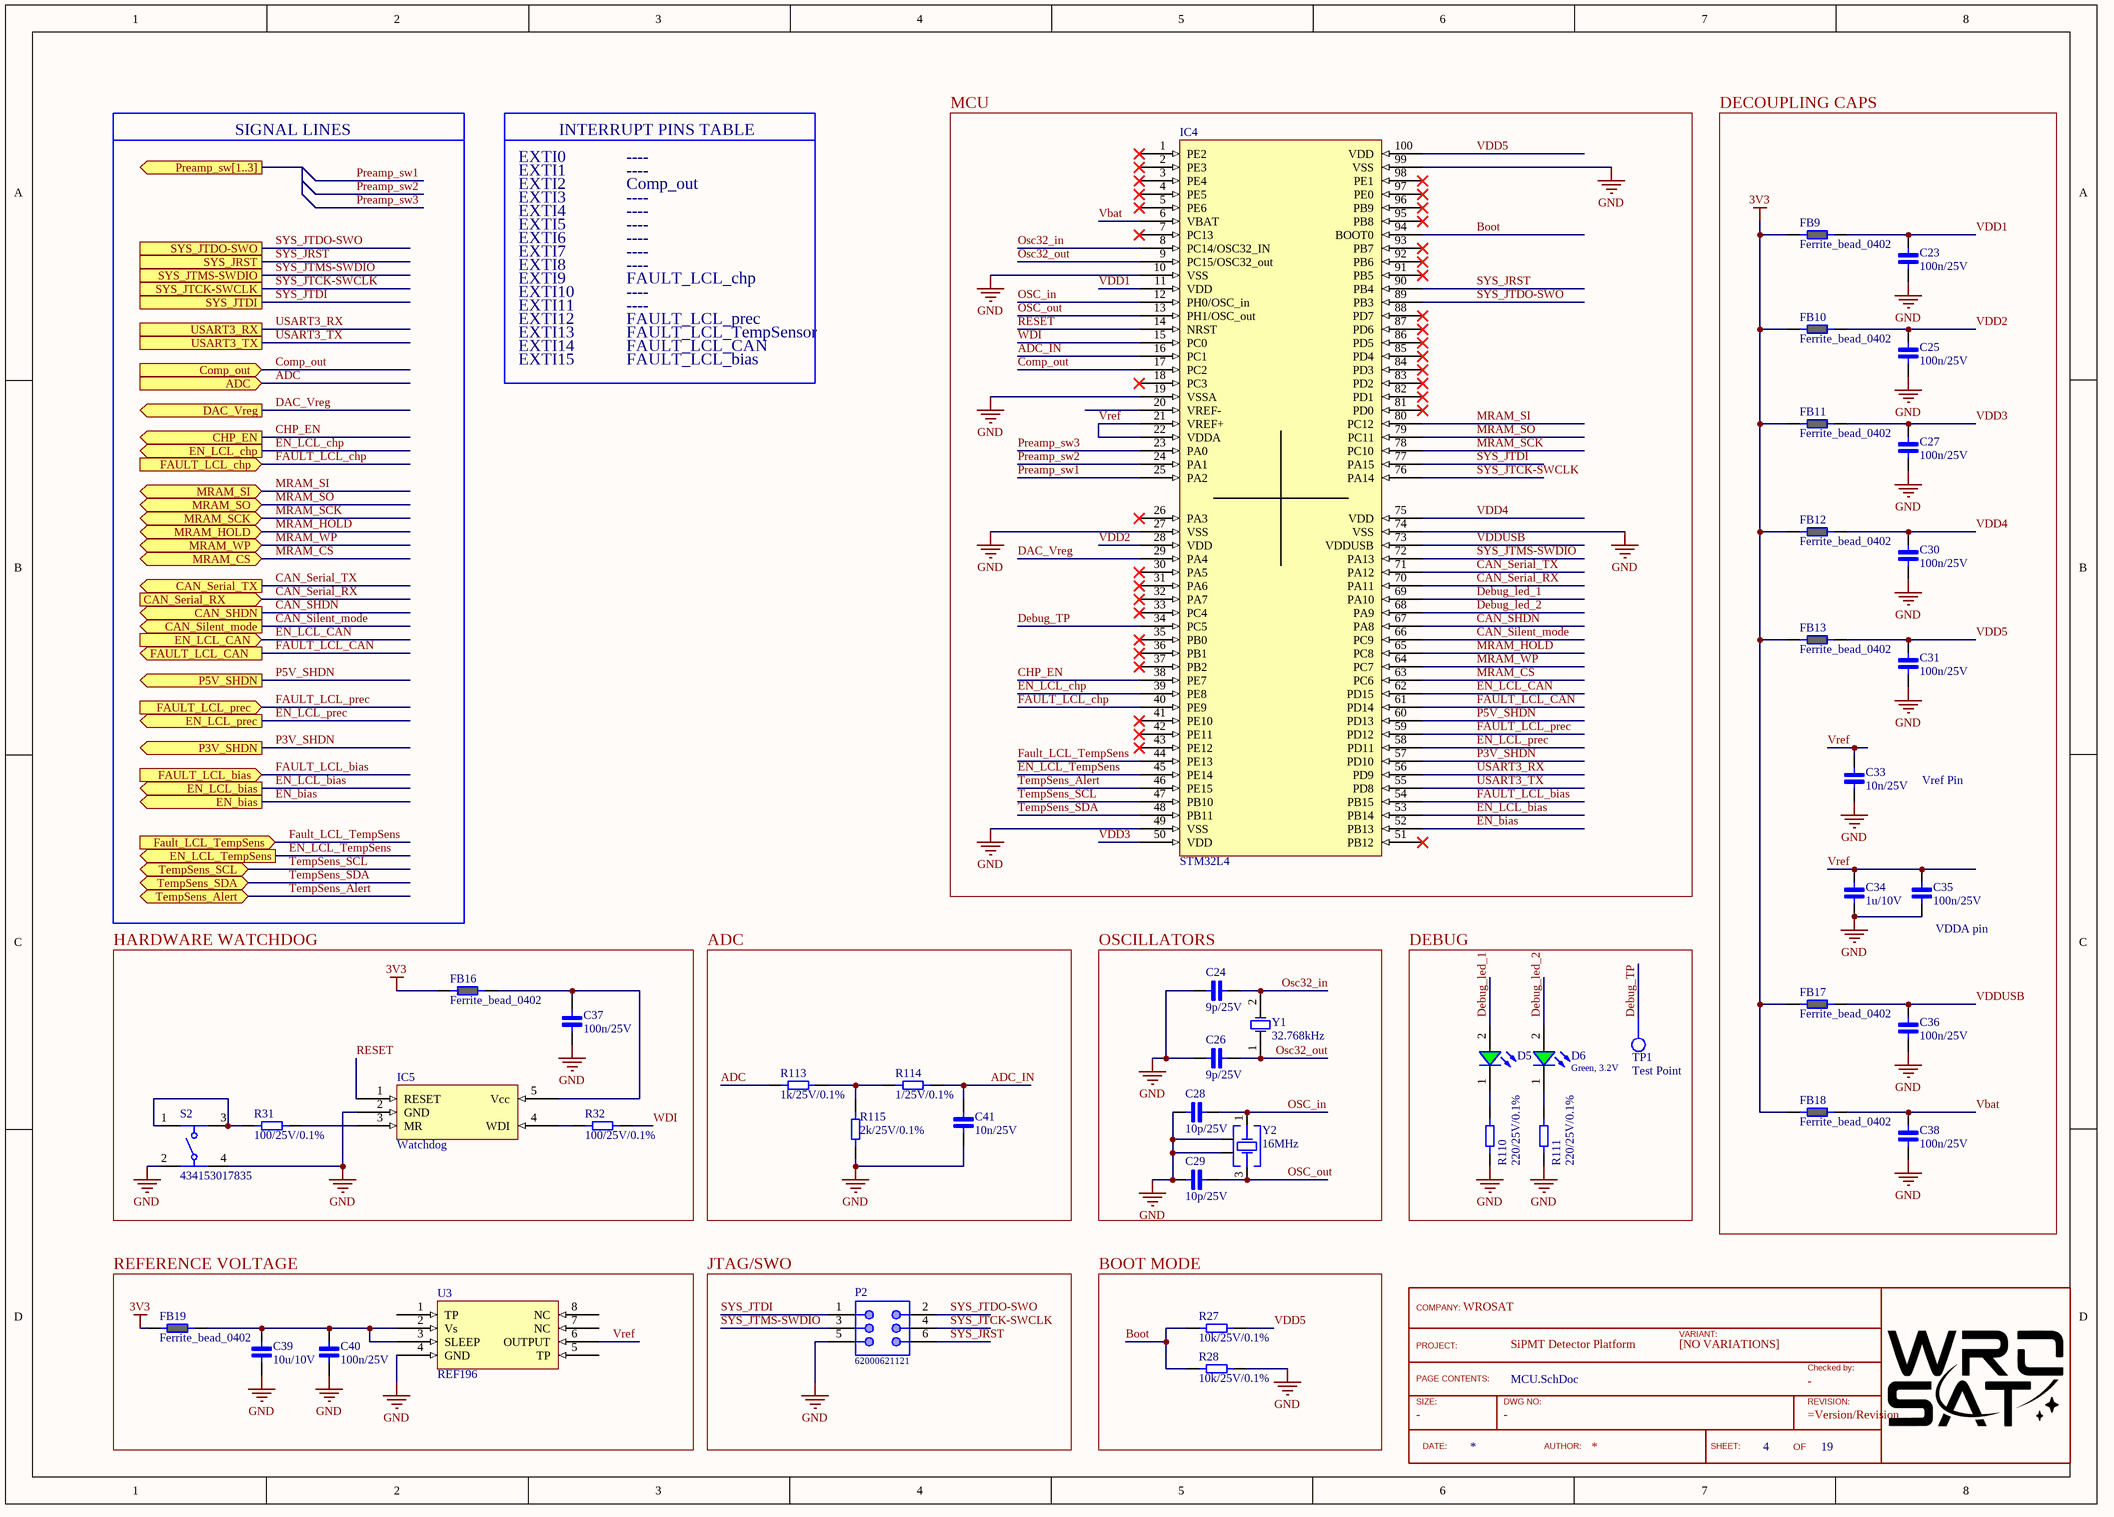
[diagram p4: MCU.SchDoc]

### Parts
(Parts that share a designator on the sheet are numbered #1, #2 ... from top to bottom, then left to right.)
?#3  TitleBlock  (value not drawn)  (graphical)
C23  100n/25V  [Cap_0402]
C24  9p/25V  [Cap_0402]
C25  100n/25V  [Cap_0402]
C26  9p/25V  [Cap_0402]
C27  100n/25V  [Cap_0402]
C28  10p/25V  [Cap_0402]
C29  10p/25V  [Cap_0402]
C30  100n/25V  [Cap_0402]
C31  100n/25V  [Cap_0402]
C33  10n/25V  [Cap_0402]
C34  1u/10V  [Cap_0402]
C35  100n/25V  [Cap_0402]
C36  100n/25V  [Cap_0402]
C37  100n/25V  [Cap_0402]
C38  100n/25V  [Cap_0402]
C39  10u/10V  [CAP_0603]
C40  100n/25V  [Cap_0402]
C41  10n/25V  [CAP_0603]
D5  Green, 3.2V  [WL-SMCW_0603_H=0.7mm]  (value not drawn)
D6  Green, 3.2V  [WL-SMCW_0603_H=0.7mm]
FB9  Ferrite_bead_0402  [FERRITE_0402]
FB10  Ferrite_bead_0402  [FERRITE_0402]
FB11  Ferrite_bead_0402  [FERRITE_0402]
FB12  Ferrite_bead_0402  [FERRITE_0402]
FB13  Ferrite_bead_0402  [FERRITE_0402]
FB16  Ferrite_bead_0402  [FERRITE_0402]
FB17  Ferrite_bead_0402  [FERRITE_0402]
FB18  Ferrite_bead_0402  [FERRITE_0402]
FB19  Ferrite_bead_0402  [FERRITE_0402]
IC4  STM32L4  [LQFP100]
IC5  Watchdog  [SOT-23-5]
P2  62000621121  [62000621121]
R27  10k/25V/0.1%  [RES_0402]
R28  10k/25V/0.1%  [RES_0402]
R31  100/25V/0.1%  [RES_0402]
R32  100/25V/0.1%  [RES_0402]
R110  220/25V/0.1%  [RES_0402]
R111  220/25V/0.1%  [RES_0402]
R113  1k/25V/0.1%  [RES_0402]
R114  1/25V/0.1%  [RES_0402]
R115  2k/25V/0.1%  [RES_0402]
S2  434153017835  [434153017835]
TP1  Test Point  [Test Point SMT]
U3  REF196  [SOIC8]
Y1  32.768kHz  [WE-XTAL_IQXC-25]
Y2  16MHz  [WE-XTAL_CFPX-218]

### Blocks framed on the sheet
MCU: IC4
DECOUPLING CAPS: C23 C25 C27 C30 C31 C33-C36 C38 FB9-FB13 FB17 FB18
HARDWARE WATCHDOG: C37 FB16 IC5 R31 R32 S2
ADC: C41 R113-R115
OSCILLATORS: C24 C26 C28 C29 Y1 Y2
DEBUG: D5 D6 R110 R111 TP1
REFERENCE VOLTAGE: C39 C40 FB19 U3
JTAG/SWO: P2
BOOT MODE: R27 R28

### Ports
ADC (in), CAN_Serial_RX (in), CAN_Serial_TX (out), CAN_SHDN (out), CAN_Silent_mode (out), CHP_EN (out), Comp_out (in), DAC_Vreg (out), EN_bias (out), EN_LCL_bias (out), EN_LCL_CAN (in), EN_LCL_chp (out), EN_LCL_prec (out), EN_LCL_TempSens (out), FAULT_LCL_bias (in), FAULT_LCL_CAN (out), FAULT_LCL_chp (in), FAULT_LCL_prec (in), Fault_LCL_TempSens (in), MRAM_CS (bidir), MRAM_HOLD (bidir), MRAM_SCK (bidir), MRAM_SI (bidir), MRAM_SO (bidir), MRAM_WP (bidir), P3V_SHDN (out), P5V_SHDN (out), Preamp_sw[1..3] (out), SYS_JRST, SYS_JTCK-SWCLK, SYS_JTDI, SYS_JTDO-SWO, SYS_JTMS-SWDIO, TempSens_Alert (bidir), TempSens_SCL (bidir), TempSens_SDA (bidir), USART3_RX, USART3_TX

### Nets
3V3: FB9.1 FB10.1 FB11.1 FB12.1 FB13.1 FB16.1 FB17.1 FB18.1 FB19.1
GND: C23.1 C24.1 C25.1 C26.1 C27.1 C28.1 C29.1 C30.1 C31.1 C33.1 C34.1 C35.1 C36.1 C37.1 C38.1 C39.1 C40.1 C41.1 IC4.10(VSS) IC4.19(VSSA) IC4.27(VSS) IC4.49(VSS) IC4.74(VSS) IC4.99(VSS) IC5.2(GND) P2.5 R28.2 R110.1 R111.1 R115.1 S2.2 S2.4 U3.4(GND) Y2.2(GND) Y2.4(GND)
ADC: R113.1 ; port ADC
ADC_IN: C41.2 IC4.16(PC1) R114.2
Boot: IC4.94(BOOT0) R27.1 R28.1
CAN_Serial_RX: IC4.70(PA11) ; port CAN_Serial_RX
CAN_Serial_TX: IC4.71(PA12) ; port CAN_Serial_TX
CAN_SHDN: IC4.67(PA8) ; port CAN_SHDN
CAN_Silent_mode: IC4.66(PC9) ; port CAN_Silent_mode
CHP_EN: IC4.38(PE7) ; port CHP_EN
Comp_out: IC4.17(PC2) ; port Comp_out
DAC_Vreg: IC4.29(PA4) ; port DAC_Vreg
Debug_led_1: D5.2(A) IC4.69(PA10)
Debug_led_2: D6.2(A) IC4.68(PA9)
Debug_TP: IC4.34(PC5) TP1.1
EN_bias: IC4.52(PB13) ; port EN_bias
EN_LCL_bias: IC4.53(PB14) ; port EN_LCL_bias
EN_LCL_CAN: IC4.62(PD15) ; port EN_LCL_CAN
EN_LCL_chp: IC4.39(PE8) ; port EN_LCL_chp
EN_LCL_prec: IC4.58(PD11) ; port EN_LCL_prec
EN_LCL_TempSens: IC4.45(PE14) ; port EN_LCL_TempSens
FAULT_LCL_bias: IC4.54(PB15) ; port FAULT_LCL_bias
FAULT_LCL_CAN: IC4.61(PD14) ; port FAULT_LCL_CAN
FAULT_LCL_chp: IC4.40(PE9) ; port FAULT_LCL_chp
FAULT_LCL_prec: IC4.59(PD12) ; port FAULT_LCL_prec
Fault_LCL_TempSens: IC4.44(PE13) ; port Fault_LCL_TempSens
MRAM_CS: IC4.63(PC6) ; port MRAM_CS
MRAM_HOLD: IC4.65(PC8) ; port MRAM_HOLD
MRAM_SCK: IC4.78(PC10) ; port MRAM_SCK
MRAM_SI: IC4.80(PC12) ; port MRAM_SI
MRAM_SO: IC4.79(PC11) ; port MRAM_SO
MRAM_WP: IC4.64(PC7) ; port MRAM_WP
Osc32_in: C24.2 IC4.8(PC14/OSC32_IN) Y1.2(OSC2)
Osc32_out: C26.2 IC4.9(PC15/OSC32_out) Y1.1(OSC1)
OSC_in: C28.2 IC4.12(PH0/OSC_in) Y2.1(Crystal)
OSC_out: C29.2 IC4.13(PH1/OSC_out) Y2.3(Crystal)
p3V_SHDN: IC4.57(PD10) ; port P3V_SHDN
P5V_SHDN: IC4.60(PD13) ; port P5V_SHDN
Preamp_sw1: IC4.25(PA2)
Preamp_sw2: IC4.24(PA1)
Preamp_sw3: IC4.23(PA0)
RESET: IC4.14(NRST) IC5.1(RESET)
SYS_JRST: IC4.90(PB4) P2.6 ; port SYS_JRST
SYS_JTCK-SWCLK: IC4.76(PA14) P2.4 ; port SYS_JTCK-SWCLK
SYS_JTDI: IC4.77(PA15) P2.1 ; port SYS_JTDI
SYS_JTDO-SWO: IC4.89(PB3) P2.2 ; port SYS_JTDO-SWO
SYS_JTMS-SWDIO: IC4.72(PA13) P2.3 ; port SYS_JTMS-SWDIO
TempSens_Alert: IC4.46(PE15) ; port TempSens_Alert
TempSens_SCL: IC4.47(PB10) ; port TempSens_SCL
TempSens_SDA: IC4.48(PB11) ; port TempSens_SDA
USART3_RX: IC4.56(PD9) ; port USART3_RX
USART3_TX: IC4.55(PD8) ; port USART3_TX
Vbat: C38.2 FB18.2 IC4.6(VBAT)
VDD1: C23.2 FB9.2 IC4.11(VDD)
VDD2: C25.2 FB10.2 IC4.28(VDD)
VDD3: C27.2 FB11.2 IC4.50(VDD)
VDD4: C30.2 FB12.2 IC4.75(VDD)
VDD5: C31.2 FB13.2 IC4.100(VDD) R27.2
VDDUSB: C36.2 FB17.2 IC4.73(VDDUSB)
Vref: C33.2 C34.2 C35.2 IC4.21(VREF+) IC4.22(VDDA) U3.6(OUTPUT)
WDI: IC4.15(PC0) R32.2
NetC37_2: C37.2 FB16.2 IC5.5(Vcc)
NetC39_2: C39.2 C40.2 FB19.2 U3.2(Vs) U3.3(SLEEP)
NetD5_1: D5.1(K) R110.2
NetD6_1: D6.1(K) R111.2
NetIC5_3: IC5.3(MR) R31.2
NetIC5_4: IC5.4(WDI) R32.1
NetR31_1: R31.1 S2.1 S2.3
NetR113_2: R113.2 R114.1 R115.2

Not connected (* = marked no-connect by the designer): IC4 1(PE2)* 2(PE3)* 3(PE4)* 4(PE5)* 5(PE6)* 7(PC13)* 18(PC3)* 20(VREF-) 26(PA3)* 30(PA5)* 31(PA6)* 32(PA7)* 33(PC4)* 35(PB0)* 36(PB1)* 37(PB2)* 41(PE10)* 42(PE11)* 43(PE12)* 51(PB12)* 81(PD0)* 82(PD1)* 83(PD2)* 84(PD3)* 85(PD4)* 86(PD5)* 87(PD6)* 88(PD7)* 91(PB5)* 92(PB6)* 93(PB7)* 95(PB8)* 96(PB9)* 97(PE0)* 98(PE1)*; U3 1(TP) 5(TP) 7(NC) 8(NC)

### Notes on the sheet
- SIGNAL LINES
- EXTI0
- EXTI1
- INTERRUPT PINS TABLE
- ----
- EXTI2
- EXTI3
- EXTI4
- EXTI5
- EXTI6
- Comp_out
- EXTI7
- EXTI8
- EXTI9
- EXTI10
- EXTI11
- FAULT_LCL_chp
- EXTI12
- EXTI13
- EXTI14
- EXTI15
- FAULT_LCL_prec
- FAULT_LCL_CAN
- FAULT_LCL_bias
- FAULT_LCL_TempSensor
- Vref Pin
- (near C35) VDDA pin
- Title
- Size:
- Date:
- A3
- Number:
- Time:
- Revision:
- Sheet
- of
- File:
- (in symbol TitleBlock) COMPANY:; VARIANT:; PROJECT:; [NO VARIATIONS]; Checked by:; PAGE CONTENTS:; SIZE:; DWG NO:; REVISION:; DATE:; AUTHOR:; SHEET:; OF

### Library data of the parts
?#3 = TitleBlock: Standard TitleBlock; DrawingNo: -; Size: -; Checked: -
C23 C25 C27 C30 C31 C35-C38 C40 = Cap_0402_100n: as C3 on sheet Preamplifier; ComponentLink1Description: New link; ComponentLink1URL: https://www.we-online.com/catalog/en/WCAP-CSGP-25VDC
C24 C26 = Cap_0402_9p: 0402 / 25V / ±5%, Wurth Elektronik MLCC; ComponentLink1Description: New link; ComponentLink1URL: https://www.we-online.com/catalog/en/WCAP-CSGP-25VDC
C28 C29 = Cap_0402_10p: 0402 / 25V / ±5%, Wurth Elektronik MLCC; ComponentLink1Description: New link; ComponentLink1URL: https://www.we-online.com/catalog/en/WCAP-CSGP-25VDC
C33 = Cap_0402_10n: as C32 on sheet General_design; ComponentLink1Description: New link; ComponentLink1URL: https://www.we-online.com/catalog/en/WCAP-CSGP-25VDC
C34 = Cap_0402_1u: as C20 on sheet PIN_bias_voltage
C39 = Cap_0603_10u: Ceramic Capacitor 10uF / 0603 / 10V / ±5%, Wurth Elektronik MLCC
C41 = Cap_0603_10n: Ceramic Capacitor 10n / 0603 / 25V / ±5%, Wurth Elektronik MLCC; ComponentLink1Description: New link; ComponentLink1URL: https://www.we-online.com/catalog/en/WCAP-CSGP-25VDC
D5 D6 = 150060GS75000: as D3 on sheet General_design; Viewing Angle: 140deg; ComponentLink1Description: Manufacturer; ComponentLink1URL: http://www.we-online.de; ComponentLink2URL: https://www.we-online.com/catalog/datasheet/150060GS75000.pdf; ComponentLink2Description: Datasheet; Forward Voltage typ.: 3.2V; Emitting Color: Green; Mounting Technology: SMT; Operating Temperature: -40 to +85degC; Published Date: December 2019; Part Number: 150060GS75000; Packaging: Tape and Reel; Size: 0603; Publisher: Wurth Elektronik
FB9-FB13 FB16-FB19 = Ferrite_bead_0402: Ferrite bead, wurth 74269241102
IC4 = STM32L476VGT6: Microcontroller STM32; ComponentLink1Description: New link; ComponentLink1URL: https://www.digchip.com/datasheets/parts/datasheet/456/STM32L476-pdf.php
IC5 = MAX823: Watchdog, 5-Pin Microprocessor Supervisory Circuits With / Watchdog Timer and Manual Reset; ComponentLink1Description: New link; ComponentLink1URL: https://pl.mouser.com/datasheet/2/256/MAX823-MAX825Z-1116133.pdf
P2 = 62000621121: WR-PHD Pin Header, THT, pitch 2mm, Dual Row, Vertical, 6p; Manufacturer: Wurth Elektronik; Pin Number: 6; Rated Current: 2A; Working Voltage: 200VAC; Withstanding Voltage: 500VAC; Contact Resistance: 20mOhm; ComponentLink1Description: Manufacturer; ComponentLink1URL: http://www.we-online.de; ComponentLink2Description: Datasheet; ComponentLink2URL: https://www.we-online.com/catalog/datasheet/62000621121.pdf; Operating Temperature: -40 to +105degC; Published Date: May 2020; Pitch: 2mm; Manufacturer Part Number: 62000621121; Mounting Technology: THT; Packaging: Bag; Gender: Pin Header; Row Number: Dual; Orientation: Vertical
R27 R28 = Res_0402_10k: Vishay, thin film resistor 10k/25V/0.1%
R31 R32 = Res_0402_100: Vishay, thin film resistor 100/25V/0.1%
R110 R111 R114 = Res_0402_1: Vishay, thin film resistor 1/25V/0.1%
R113 = Res_0402_1k: Vishay, thin film resistor 1k/25V/0.1%
R115 = Res_0402_1k: Vishay, thin film resistor 2k/25V/0.1%
S2 = 434153017835: WS-TASV J-Bend SMT Tact Switch, 3.5x2.9x1.7mm, 350gf; Manufacturer: Wurth Elektronik; Rated Voltage: 12VDC; Rated Current: 50mA; Washable: No; ComponentLink1Description: Manufacturer; ComponentLink1URL: http://www.we-online.de; ComponentLink2Description: Datasheet; ComponentLink2URL: https://www.we-online.com/catalog/datasheet/434153017835.pdf; Operating Temperature: -40 to +85degC; Manufacturer Part Number: 434153017835; Published Date: November 2020; Contact Material: Stainless Steel; Size: 3.5x2.9x1.7mm; Mounting Technology: SMT; Contact Plating: Silver; Operation Force: 350gf; Packaging: Tape and Reel; Terminal Material: Copper Alloy; Terminal Plating: Silver
U3 = REF196: Precision Micropower, / Low Dropout Voltage References; ComponentLink1Description: New link; ComponentLink1URL: https://www.analog.com/media/en/technical-documentation/data-sheets/REF19xSeries.pdf
Y1 = 830062558: WE-XTAL Watch Crystal, SMT, IQXC-25, 32.768kHz, +/-10ppm; Manufacturer: Wurth Elektronik; Load Capacitance: 9pF; ComponentLink1Description: Manufacturer; ComponentLink1URL: http://www.we-online.de; ComponentLink2Description: Datasheet; ComponentLink2URL: https://katalog.we-online.com/pbs/datasheet/830062558.pdf; Operating Temperature: -40 to +85degC; Packaging: Tape and Reel; Manufacturer Part Number: 830062558; Published Date: July 2020; Size: IQXC-25; Frequency Stability: -; Frequency: 32.768kHz; Frequency Tolerance: +/-10ppm; Mounting Technology: SMT
Y2 = 830069392: WE-XTAL Quartz Crystal, SMT, CFPX-218, 16MHz, +/-20ppm; Manufacturer: Wurth Elektronik; Load Capacitance: 10pF; ComponentLink1Description: Manufacturer; ComponentLink1URL: http://www.we-online.de; ComponentLink2Description: Datasheet; ComponentLink2URL: https://katalog.we-online.com/pbs/datasheet/830069392.pdf; Operating Temperature: -40 to +85degC; Packaging: Tape and Reel; Manufacturer Part Number: 830069392; Published Date: July 2020; Size: CFPX-218; Frequency Stability: +/-20ppm; Frequency: 16MHz; Frequency Tolerance: +/-20ppm; Mounting Technology: SMT

## Sheet Comparator.SchDoc
size A3; Organization: Altium Limited; Address1: L3, 12a Rodborough Rd; Address2: Frenchs Forest; Address3: NSW; Address4: Australia 2086; DocumentNumber: 5; SheetNumber: 5; SheetTotal: 19
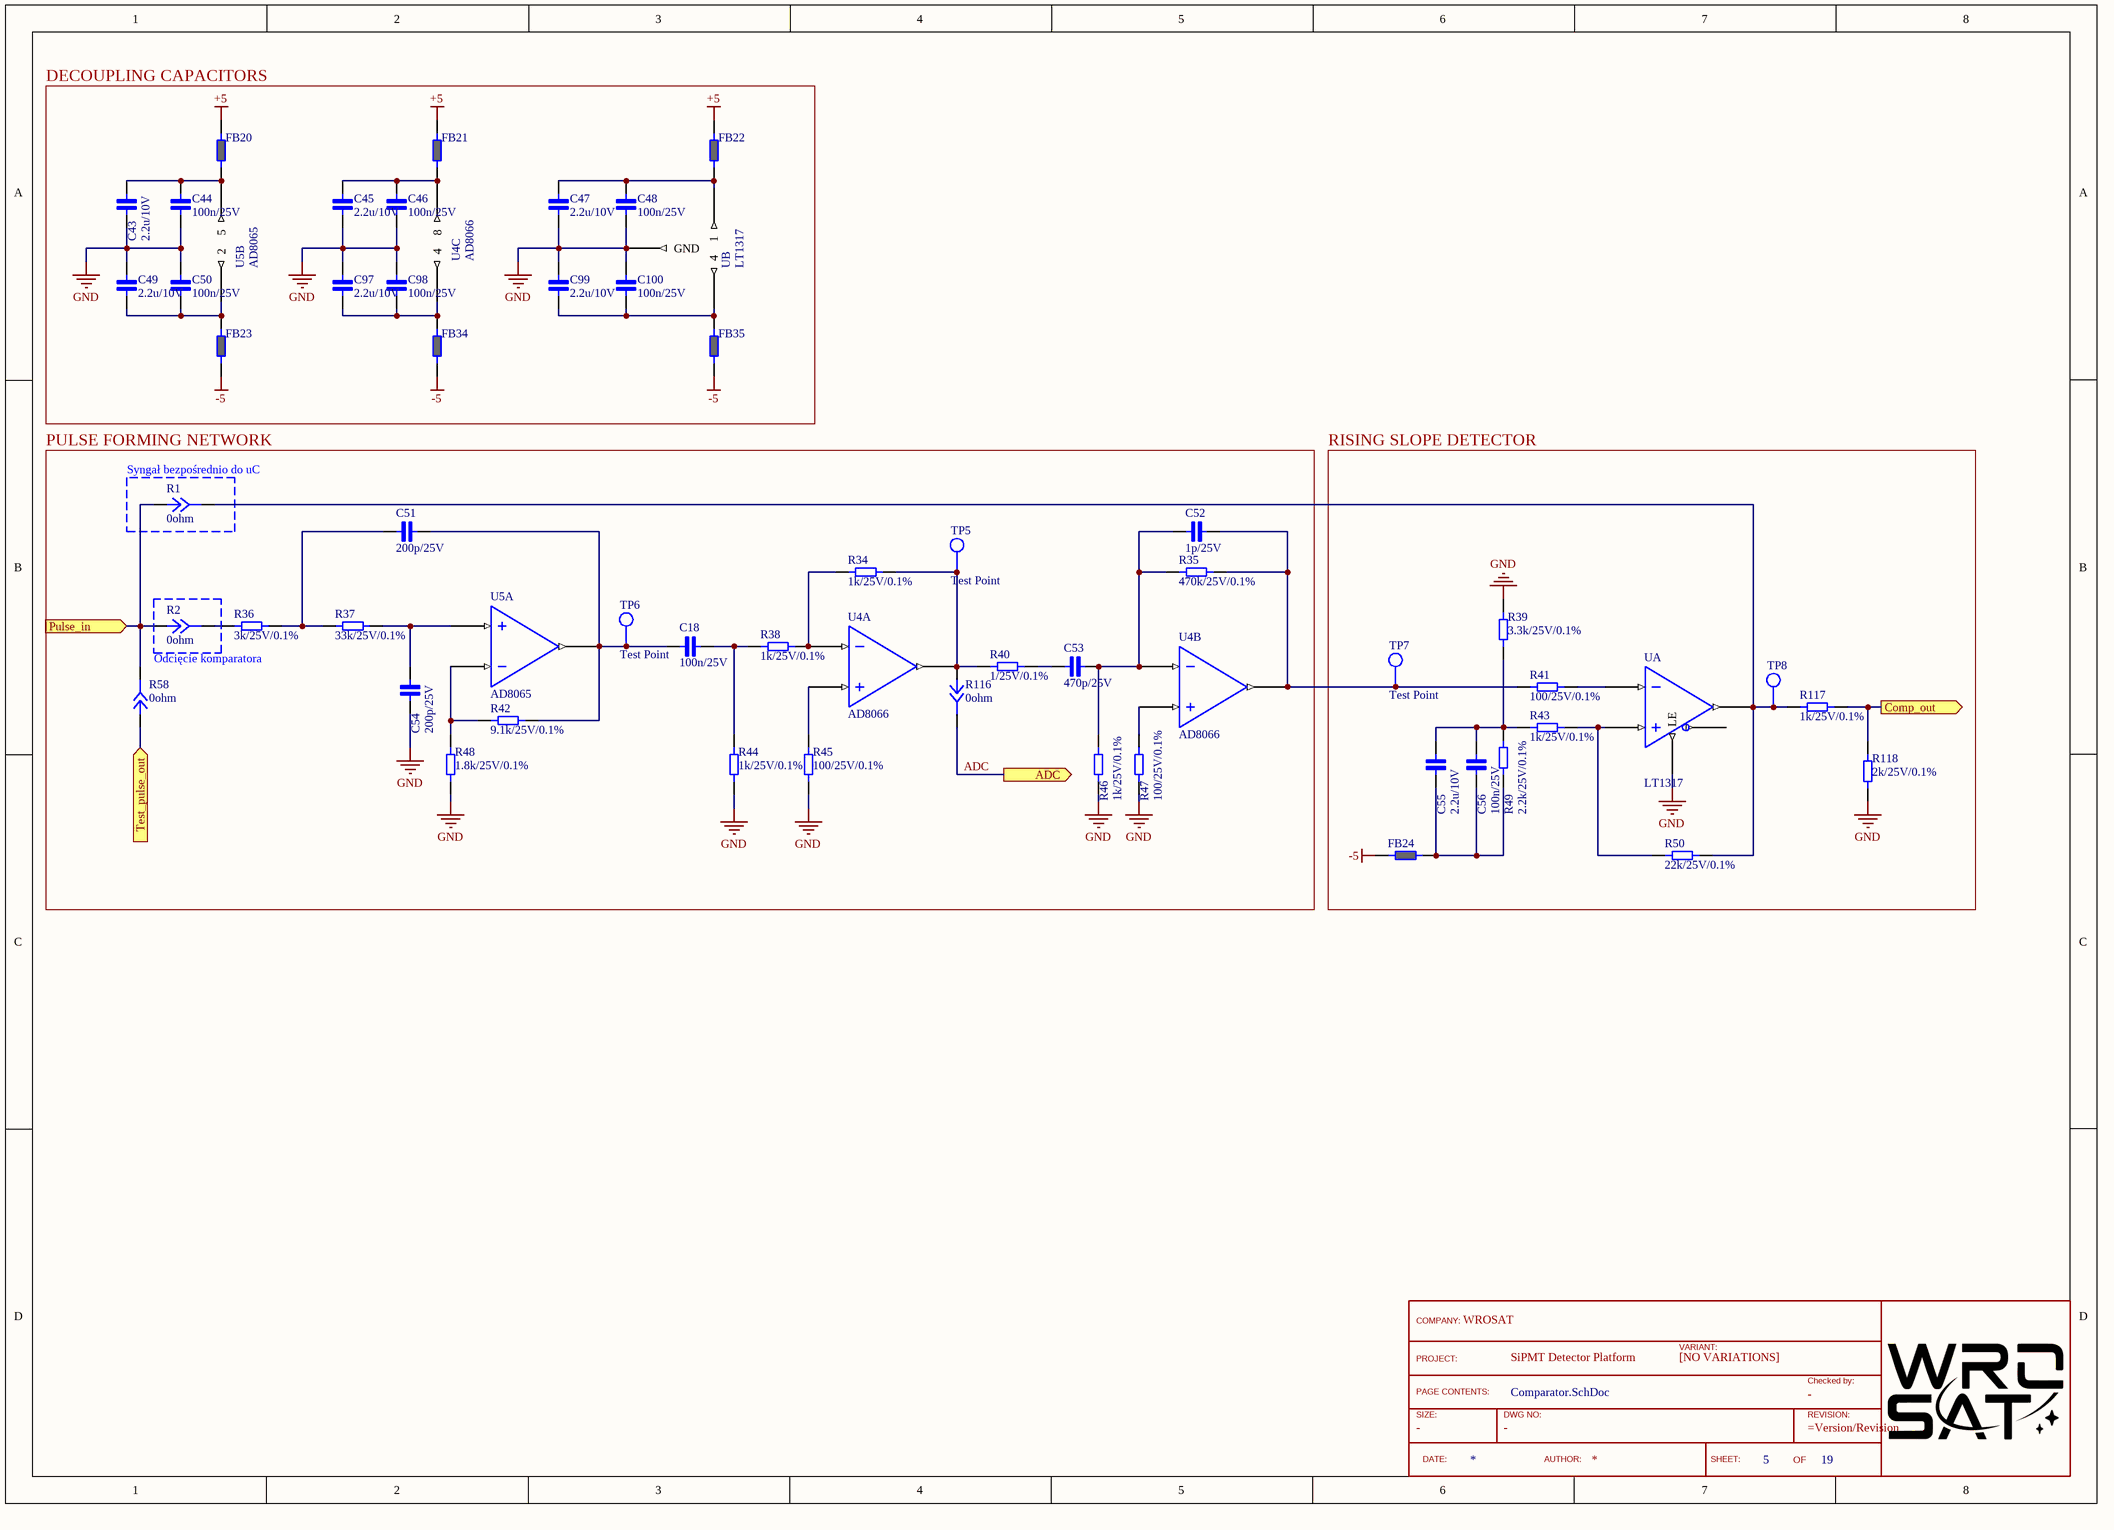
[diagram p5: Comparator.SchDoc]

### Parts
(Parts that share a designator on the sheet are numbered #1, #2 ... from top to bottom, then left to right.)
?#4  TitleBlock  (value not drawn)  (graphical)
C18  100n/25V  [Cap_0402]
C43  2.2u/10V  [Cap_0402]
C44  100n/25V  [Cap_0402]
C45  2.2u/10V  [Cap_0402]
C46  100n/25V  [Cap_0402]
C47  2.2u/10V  [Cap_0402]
C48  100n/25V  [Cap_0402]
C49  2.2u/10V  [Cap_0402]
C50  100n/25V  [Cap_0402]
C51  200p/25V  [Cap_0402]
C52  1p/25V  [Cap_0402]
C53  470p/25V  [Cap_0402]
C54  200p/25V  [Cap_0402]
C55  2.2u/10V  [Cap_0402]
C56  100n/25V  [Cap_0402]
C97  2.2u/10V  [Cap_0402]
C98  100n/25V  [Cap_0402]
C99  2.2u/10V  [Cap_0402]
C100  100n/25V  [Cap_0402]
FB20  Ferrite_bead_0402  [FERRITE_0402]  (value not drawn)
FB21  Ferrite_bead_0402  [FERRITE_0402]  (value not drawn)
FB22  Ferrite_bead_0402  [FERRITE_0402]  (value not drawn)
FB23  Ferrite_bead_0402  [FERRITE_0402]  (value not drawn)
FB24  Ferrite_bead_0402  [FERRITE_0402]  (value not drawn)
FB34  Ferrite_bead_0402  [FERRITE_0402]  (value not drawn)
FB35  Ferrite_bead_0402  [FERRITE_0402]  (value not drawn)
R1  0ohm  [Jumper 2]
R2  0ohm  [Jumper 2]
R34  1k/25V/0.1%  [RES_0402]
R35  470k/25V/0.1%  [RES_0402]
R36  3k/25V/0.1%  [RES_0402]
R37  33k/25V/0.1%  [RES_0402]
R38  1k/25V/0.1%  [RES_0402]
R39  3.3k/25V/0.1%  [RES_0402]
R40  1/25V/0.1%  [RES_0402]
R41  100/25V/0.1%  [RES_0402]
R42  9.1k/25V/0.1%  [RES_0402]
R43  1k/25V/0.1%  [RES_0402]
R44  1k/25V/0.1%  [RES_0402]
R45  100/25V/0.1%  [RES_0402]
R46  1k/25V/0.1%  [RES_0402]
R47  100/25V/0.1%  [RES_0402]
R48  1.8k/25V/0.1%  [RES_0402]
R49  2.2k/25V/0.1%  [RES_0402]
R50  22k/25V/0.1%  [RES_0402]
R58  0ohm  [Jumper 2]
R116  0ohm  [Jumper 2]
R117  1k/25V/0.1%  [RES_0402]
R118  2k/25V/0.1%  [RES_0402]
TP5  Test Point  [Test Point SMT]
TP6  Test Point  [Test Point SMT]
TP7  Test Point  [Test Point SMT]
TP8  Test Point  [Test Point SMT]  (value not drawn)
U  LT1317  [MSOP-8]  (parts A,B of 2)
U4  AD8066  [SOIC8]  (parts A,B,C of 3)
U5  AD8065  [SOT-23-5]  (parts A,B of 2)

### Blocks framed on the sheet
DECOUPLING CAPACITORS: C43-C50 C97-C100 FB20-FB23 FB34 FB35 U U4 U5
PULSE FORMING NETWORK: C18 C51-C54 R2 R34-R38 R40 R42 R44-R48 R58 R116 TP5 TP6 U4 U5
RISING SLOPE DETECTOR: C55 C56 FB24 R39 R41 R43 R49 R50 R117 R118 TP7 TP8 U
Syngał bezpośrednio do uC: R1

### Ports
ADC (out), Comp_out (out), Pulse_in (in), Test_pulse_out (in)

### Nets
+5: FB20.2 FB21.2 FB22.2
-5: FB23.1 FB24.1 FB34.1 FB35.1
GND: C43.1 C44.1 C45.1 C46.1 C47.1 C48.1 C49.2 C50.2 C54.1 C97.2 C98.2 C99.2 C100.2 R39.2 R44.1 R45.1 R46.2 R47.1 R48.1 R118.1 U.5(LE) U.6(GND)
ADC: R116.2 ; port ADC
Comp_out: R117.2 R118.2 ; port Comp_out
Pulse_in: R1.1 R2.1 R58.2 ; port Pulse_in
Test_pulse_out: R58.1 ; port Test_pulse_out
NetC18_1: C18.1 C51.2 R42.2 TP6.1 U5.1
NetC18_2: C18.2 R38.2 R44.2
NetC43_2: C43.2 C44.2 FB20.1 U5.5
NetC45_2: C45.2 C46.2 FB21.1 U4.8
NetC47_2: C47.2 C48.2 FB22.1 U.1
NetC49_1: C49.1 C50.1 FB23.2 U5.2
NetC51_1: C51.1 R36.2 R37.1
NetC52_1: C52.1 C53.2 R35.2 R46.1 U4.6
NetC52_2: C52.2 R35.1 R41.1 TP7.1 U4.7
NetC53_1: C53.1 R40.2
NetC54_2: C54.2 R37.2 U5.3
NetC55_1: C55.1 C56.1 FB24.2 R49.1
NetC55_2: C55.2 C56.2 R39.1 R43.1 R49.2
NetC97_1: C97.1 C98.1 FB34.2 U4.4
NetC99_1: C99.1 C100.1 FB35.2 U.4
NetR1_2: R1.2 R50.2 R117.1 TP8.1 U.7
NetR2_2: R2.2 R36.1
NetR34_1: R34.1 R40.1 R116.1 TP5.1 U4.1
NetR34_2: R34.2 R38.1 U4.2
NetR41_2: R41.2 U.3
NetR42_1: R42.1 R48.2 U5.4
NetR43_2: R43.2 R50.1 U.2
NetR45_2: R45.2 U4.3
NetR47_2: R47.2 U4.5

Not connected (* = marked no-connect by the designer): U 8

### Notes on the sheet
- Odcięcie komparatora
- Title
- Size:
- Date:
- A3
- Number:
- Time:
- Revision:
- Sheet
- of
- File:
- (in symbol TitleBlock) COMPANY:; VARIANT:; PROJECT:; [NO VARIATIONS]; Checked by:; PAGE CONTENTS:; SIZE:; DWG NO:; REVISION:; DATE:; AUTHOR:; SHEET:; OF

### Library data of the parts
?#4 = TitleBlock: Standard TitleBlock; DrawingNo: -; Size: -; Checked: -
C18 C44 C46 C48 C50 C56 C98 C100 = Cap_0402_100n: as C3 on sheet Preamplifier; ComponentLink1Description: New link; ComponentLink1URL: https://www.we-online.com/catalog/en/WCAP-CSGP-25VDC
C43 C45 C47 C49 C55 C97 C99 = Cap_0402_2.2u: as C2 on sheet Preamplifier
C51 C54 = Cap_0402_200p: 0402 / 25V / ±5%, Wurth Elektronik MLCC; ComponentLink1Description: New link; ComponentLink1URL: https://www.we-online.com/catalog/en/WCAP-CSGP-25VDC
C52 = Cap_0402_1p: 0402 / 25V / ±5%, Wurth Elektronik MLCC; ComponentLink1Description: New link; ComponentLink1URL: https://www.we-online.com/catalog/en/WCAP-CSGP-25VDC
C53 = Cap_0402_470p: 0402 / 25V / ±5%, Wurth Elektronik MLCC; ComponentLink1Description: New link; ComponentLink1URL: https://www.we-online.com/catalog/en/WCAP-CSGP-25VDC
FB20-FB24 FB34 FB35 = Ferrite_bead_0402: Ferrite bead, wurth 74269241102
R1 R2 R58 R116 = Jumper
R34 R38 R43 R44 R46 R117 R118 = Res_0402_1k: Vishay, thin film resistor 1k/25V/0.1%
R35 = Res_0402_470k: Vishay, thin film resistor 470k/25V/0.1%
R36 = Res_0402_3k: Vishay, thin film resistor 3k/25V/0.1%
R37 = Res_0402_33k: Vishay, thin film resistor 33k/25V/0.1%
R39 = Res_0402_3.3k: Vishay, thin film resistor 3.3k/25V/0.1%
R40 = Res_0402_1: Vishay, thin film resistor 1/25V/0.1%
R41 R45 R47 = Res_0402_100: Vishay, thin film resistor 100/25V/0.1%
R42 = Res_0402_9.1k: Vishay, thin film resistor 9.1k/25V/0.1%
R48 = Res_0402_1.8k: Vishay, thin film resistor 1.8k/25V/0.1%
R49 = Res_0402_2.2k: Vishay, thin film resistor 2.2k/25V/0.1%
R50 = Res_0402_22k: Vishay, thin film resistor 20k/25V/0.1%
U = LT1317: Single, 7ns, Low Power, / 3V/5V/±5V Rail-to-Rail Comparators; ComponentLink1Description: New link; ComponentLink1URL: https://pl.mouser.com/ProductDetail/Analog-Devices/LT1713CMS8PBF?qs=ytflclh7QUW98nqGG0sqzA%3D%3D
U4 = AD8066: High Performance, 145 MHz / FastFET Op Amps; ComponentLink1Description: New link; ComponentLink1URL: https://pl.mouser.com/ProductDetail/Analog-Devices/AD8066ARZ-R7?qs=%2FtpEQrCGXCwSsy1qvxfKJg%3D%3D
U5 = AD8065: High Performance, 145 MHz / FastFET Op Amps; ComponentLink1Description: New link; ComponentLink1URL: https://pl.mouser.com/datasheet/2/609/AD8065_8066-1502028.pdf

## Sheet Symmetric_PS.SchDoc
size A4; Organization: Altium Limited; Address1: L3, 12a Rodborough Rd; Address2: Frenchs Forest; Address3: NSW; Address4: Australia 2086; DocumentNumber: 6; SheetNumber: 6; SheetTotal: 19
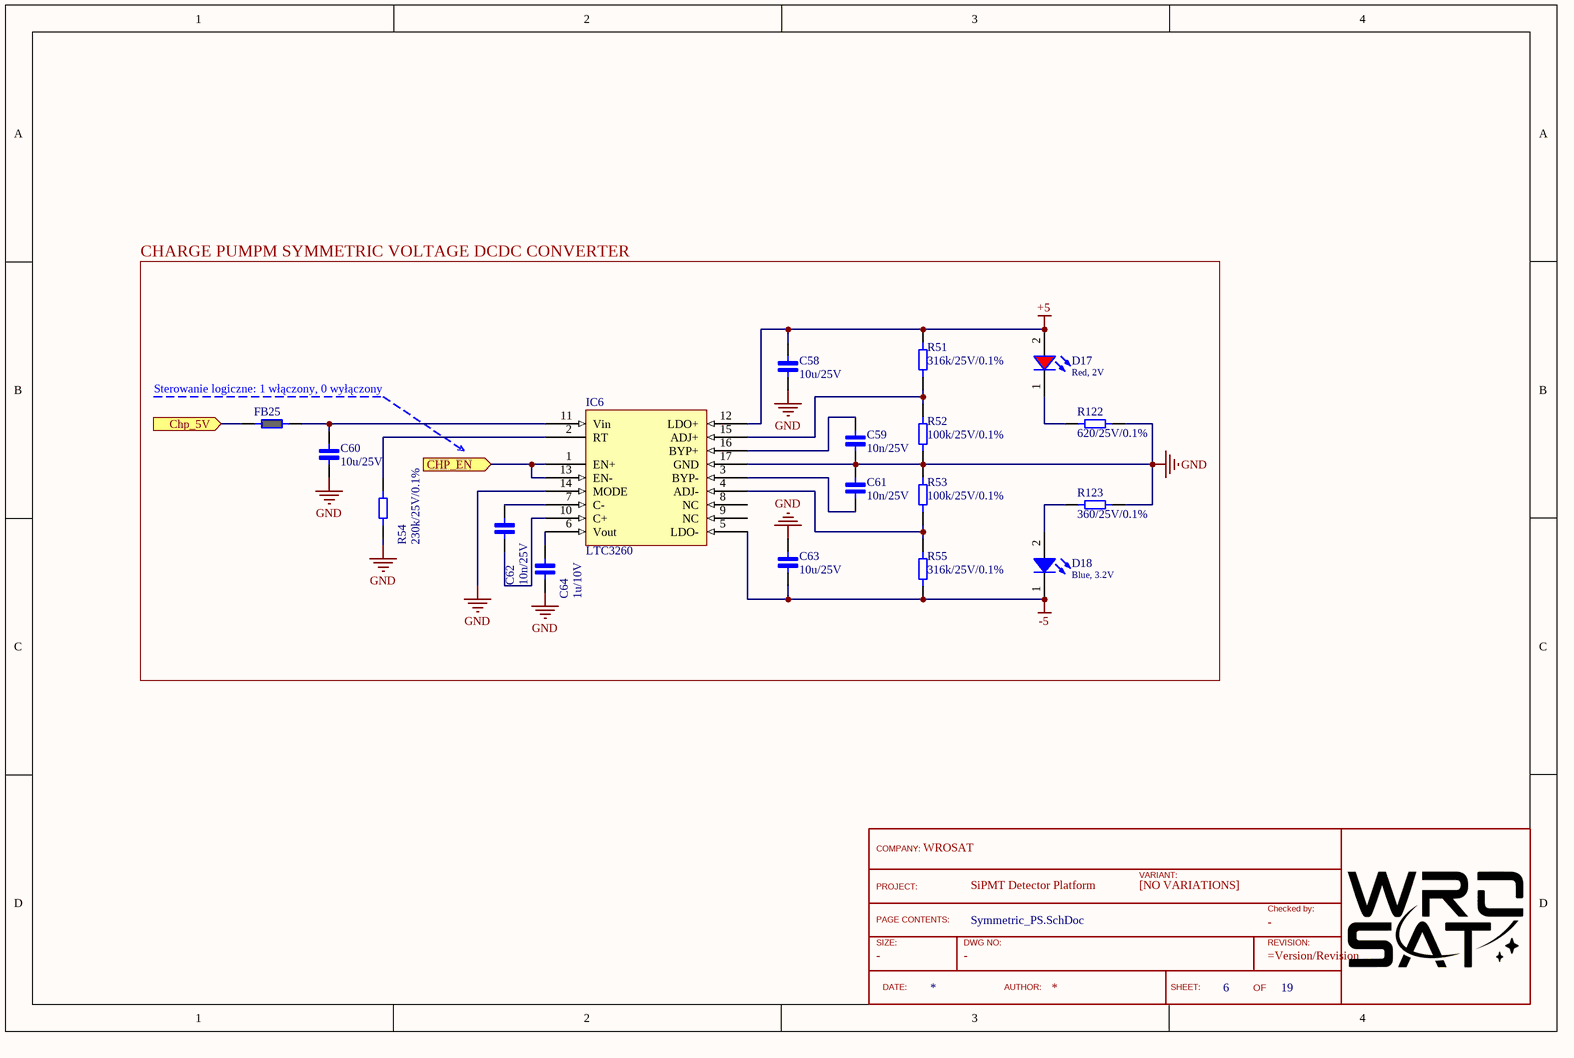
[diagram p6: Symmetric_PS.SchDoc]

### Parts
(Parts that share a designator on the sheet are numbered #1, #2 ... from top to bottom, then left to right.)
?#5  TitleBlock  (value not drawn)  (graphical)
C58  10u/25V  [CAP_0805]
C59  10n/25V  [Cap_0402]
C60  10u/25V  [CAP_0805]
C61  10n/25V  [Cap_0402]
C62  10n/25V  [Cap_0402]
C63  10u/25V  [CAP_0805]
C64  1u/10V  [Cap_0402]
D17  Red, 2V  [WL-SMCW_0603_H=0.7mm]
D18  Blue, 3.2V  [WL-SMCW_0603_H=0.7mm]
FB25  Ferrite_bead_0402  [FERRITE_0402]  (value not drawn)
IC6  LTC3260  [MSOP-16]
R51  316k/25V/0.1%  [RES_0402]
R52  100k/25V/0.1%  [RES_0402]
R53  100k/25V/0.1%  [RES_0402]
R54  230k/25V/0.1%  [RES_0402]
R55  316k/25V/0.1%  [RES_0402]
R122  620/25V/0.1%  [RES_0402]
R123  360/25V/0.1%  [RES_0402]

### Blocks framed on the sheet
CHARGE PUMPM SYMMETRIC VOLTAGE DCDC CONVERTER: C58-C64 D17 D18 FB25 IC6 R51-R55 R122 R123

### Ports
Chp_5V (in), CHP_EN (in)

### Nets
+5: C58.2 D17.2(A) IC6.12(LDO+) R51.2
-5: C63.1 D18.1(K) IC6.5(LDO-) R55.1
GND: C58.1 C59.1 C60.1 C61.2 C63.2 C64.1 IC6.14(MODE) IC6.17(GND) R52.1 R53.2 R54.1 R122.1 R123.2
Chp_5V: FB25.1 ; port Chp_5V
CHP_EN: IC6.1(EN+) IC6.13(EN-) ; port CHP_EN
NetC59_2: C59.2 IC6.16(BYP+)
NetC60_2: C60.2 FB25.2 IC6.11(Vin)
NetC61_1: C61.1 IC6.3(BYP-)
NetC62_1: C62.1 IC6.10(C+)
NetC62_2: C62.2 IC6.7(C-)
NetC64_2: C64.2 IC6.6(Vout)
NetD17_1: D17.1(K) R122.2
NetD18_2: D18.2(A) R123.1
NetIC6_2: IC6.2(RT) R54.2
NetIC6_4: IC6.4(ADJ-) R53.1 R55.2
NetIC6_15: IC6.15(ADJ+) R51.1 R52.2

Not connected (* = marked no-connect by the designer): IC6 8(NC) 9(NC)

### Notes on the sheet
- (near FB25) Sterowanie logiczne: 1 włączony, 0 wyłączony
- Title
- Size:
- Date:
- A3
- Number:
- Time:
- Revision:
- Sheet
- of
- File:
- (in symbol TitleBlock) COMPANY:; VARIANT:; PROJECT:; [NO VARIATIONS]; Checked by:; PAGE CONTENTS:; SIZE:; DWG NO:; REVISION:; DATE:; AUTHOR:; SHEET:; OF

### Library data of the parts
?#5 = TitleBlock: Standard TitleBlock; DrawingNo: -; Size: -; Checked: -
C58 C60 C63 = Cap_0805_10u_25v: Ceramic Capacitor 10uF / 0805 / 25V / ±5%, Wurth Elektronik MLCC
C59 C61 C62 = Cap_0402_10n: as C32 on sheet General_design; ComponentLink1Description: New link; ComponentLink1URL: https://www.we-online.com/catalog/en/WCAP-CSGP-25VDC
C64 = Cap_0402_1u: as C20 on sheet PIN_bias_voltage
D17 = 150060RS75000: WL-SMCW SMT Mono-color Chip LED Waterclear, size 0603, Red, 2V, 140deg; Chip Technology: AlInGaP; Dominant Wavelength typ.: 625nm; Luminous Intensity typ.: 250mcd; Peak Wavelength typ.: 630nm; Viewing Angle: 140deg; ComponentLink1Description: Manufacturer; ComponentLink1URL: http://www.we-online.de; ComponentLink2URL: https://www.we-online.com/catalog/datasheet/150060RS75000.pdf; ComponentLink2Description: Datasheet; Forward Voltage typ.: 2V; Emitting Color: Red; Mounting Technology: SMT; Operating Temperature: -40 to +85degC; Published Date: December 2019; Part Number: 150060RS75000; Packaging: Tape and Reel; Size: 0603; Publisher: Wurth Elektronik
D18 = 150060BS75000: WL-SMCW SMT Mono-color Chip LED Waterclear, size 0603, Blue, 3.2V, 140deg; Chip Technology: InGaN; Dominant Wavelength typ.: 470nm; Luminous Intensity typ.: 145mcd; Peak Wavelength typ.: 465nm; Viewing Angle: 140deg; ComponentLink1Description: Manufacturer; ComponentLink1URL: http://www.we-online.de; ComponentLink2URL: https://www.we-online.com/catalog/datasheet/150060BS75000.pdf; ComponentLink2Description: Datasheet; Forward Voltage typ.: 3.2V; Emitting Color: Blue; Mounting Technology: SMT; Operating Temperature: -40 to +85degC; Published Date: December 2019; Part Number: 150060BS75000; Packaging: Tape and Reel; Size: 0603; Publisher: Wurth Elektronik
FB25 = Ferrite_bead_0402: Ferrite bead, wurth 74269241102
IC6 = LTC3260: Charge pump, low noise; ComponentLink1Description: New link; ComponentLink1URL: https://pl.mouser.com/datasheet/2/609/3260fa-1271271.pdf
R51 R55 = Res_0402_316k: Vishay, thin film resistor 316k/25V/0.1%
R52 R53 = Res_0402_100k: Vishay, thin film resistor 100k/25V/0.1%
R54 = Res_0402_230k: Vishay, thin film resistor 230k/25V/0.1%
R122 R123 = Res_0402_1: Vishay, thin film resistor 1/25V/0.1%

## Sheet prec_3V_LDO.SchDoc
size A4; Organization: Altium Limited; Address1: L3, 12a Rodborough Rd; Address2: Frenchs Forest; Address3: NSW; Address4: Australia 2086; DocumentNumber: 8; SheetNumber: 8; SheetTotal: 19
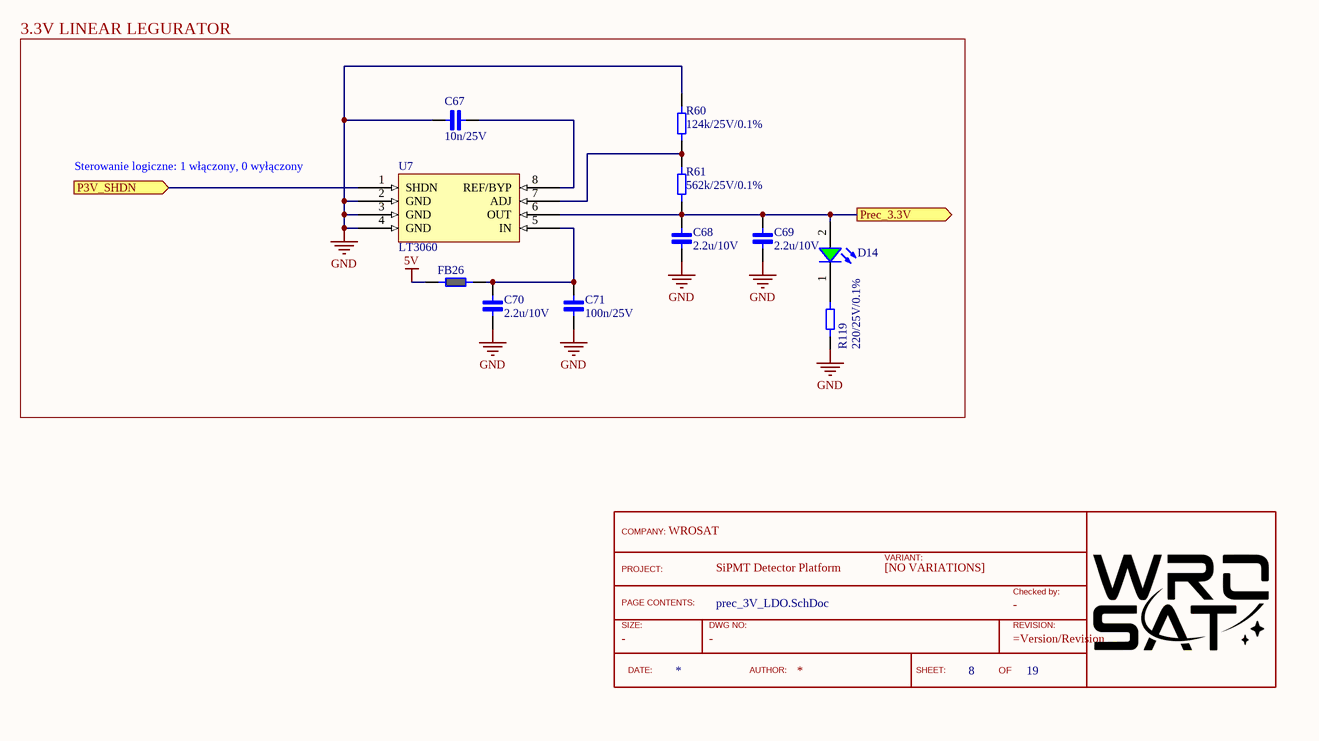
[diagram p7: prec_3V_LDO.SchDoc]

### Parts
(Parts that share a designator on the sheet are numbered #1, #2 ... from top to bottom, then left to right.)
?#6  TitleBlock  (value not drawn)  (graphical)
C67  10n/25V  [Cap_0402]
C68  2.2u/10V  [Cap_0402]
C69  2.2u/10V  [Cap_0402]
C70  2.2u/10V  [Cap_0402]
C71  100n/25V  [Cap_0402]
D14  Green, 3.2V  [WL-SMCW_0603_H=0.7mm]  (value not drawn)
FB26  Ferrite_bead_0402  [FERRITE_0402]  (value not drawn)
R60  124k/25V/0.1%  [RES_0402]
R61  562k/25V/0.1%  [RES_0402]
R119  220/25V/0.1%  [RES_0402]
U7  LT3060  [TS8]

### Blocks framed on the sheet
3.3V LINEAR LEGURATOR: C67-C71 D14 FB26 R60 R61 R119 U7

### Ports
P3V_SHDN (in), Prec_3.3V (out)

### Nets
5V: FB26.1
GND: C67.1 C68.1 C69.1 C70.1 C71.1 R60.2 R119.1 U7.2(GND) U7.3(GND) U7.4(GND)
p3V_SHDN: U7.1(SHDN) ; port P3V_SHDN
Prec_3.3V: C68.2 C69.2 D14.2(A) R61.1 U7.6(OUT) ; port Prec_3.3V
NetC67_2: C67.2 U7.8(REF/BYP)
NetC70_2: C70.2 C71.2 FB26.2 U7.5(IN)
NetD14_1: D14.1(K) R119.2
NetR60_1: R60.1 R61.2 U7.7(ADJ)

### Notes on the sheet
- Sterowanie logiczne: 1 włączony, 0 wyłączony
- Title
- Size:
- Date:
- A3
- Number:
- Time:
- Revision:
- Sheet
- of
- File:
- (in symbol TitleBlock) COMPANY:; VARIANT:; PROJECT:; [NO VARIATIONS]; Checked by:; PAGE CONTENTS:; SIZE:; DWG NO:; REVISION:; DATE:; AUTHOR:; SHEET:; OF

### Library data of the parts
?#6 = TitleBlock: Standard TitleBlock; DrawingNo: -; Size: -; Checked: -
C67 = Cap_0402_10n: as C32 on sheet General_design; ComponentLink1Description: New link; ComponentLink1URL: https://www.we-online.com/catalog/en/WCAP-CSGP-25VDC
C68-C70 = Cap_0402_2.2u: as C2 on sheet Preamplifier
C71 = Cap_0402_100n: as C3 on sheet Preamplifier; ComponentLink1Description: New link; ComponentLink1URL: https://www.we-online.com/catalog/en/WCAP-CSGP-25VDC
D14 = 150060GS75000: as D3 on sheet General_design; Viewing Angle: 140deg; ComponentLink1Description: Manufacturer; ComponentLink1URL: http://www.we-online.de; ComponentLink2URL: https://www.we-online.com/catalog/datasheet/150060GS75000.pdf; ComponentLink2Description: Datasheet; Forward Voltage typ.: 3.2V; Emitting Color: Green; Mounting Technology: SMT; Operating Temperature: -40 to +85degC; Published Date: December 2019; Part Number: 150060GS75000; Packaging: Tape and Reel; Size: 0603; Publisher: Wurth Elektronik
FB26 = Ferrite_bead_0402: Ferrite bead, wurth 74269241102
R60 = Res_0402_124k: Vishay, thin film resistor 124k/25V/0.1%
R61 = Res_0402_562k: Vishay, thin film resistor 562k/25V/0.1%
R119 = Res_0402_1: Vishay, thin film resistor 1/25V/0.1%
U7 = Lt3060: 45V VIN, Micropower, / Low Noise, 100mA Low / Dropout, Linear Regulator